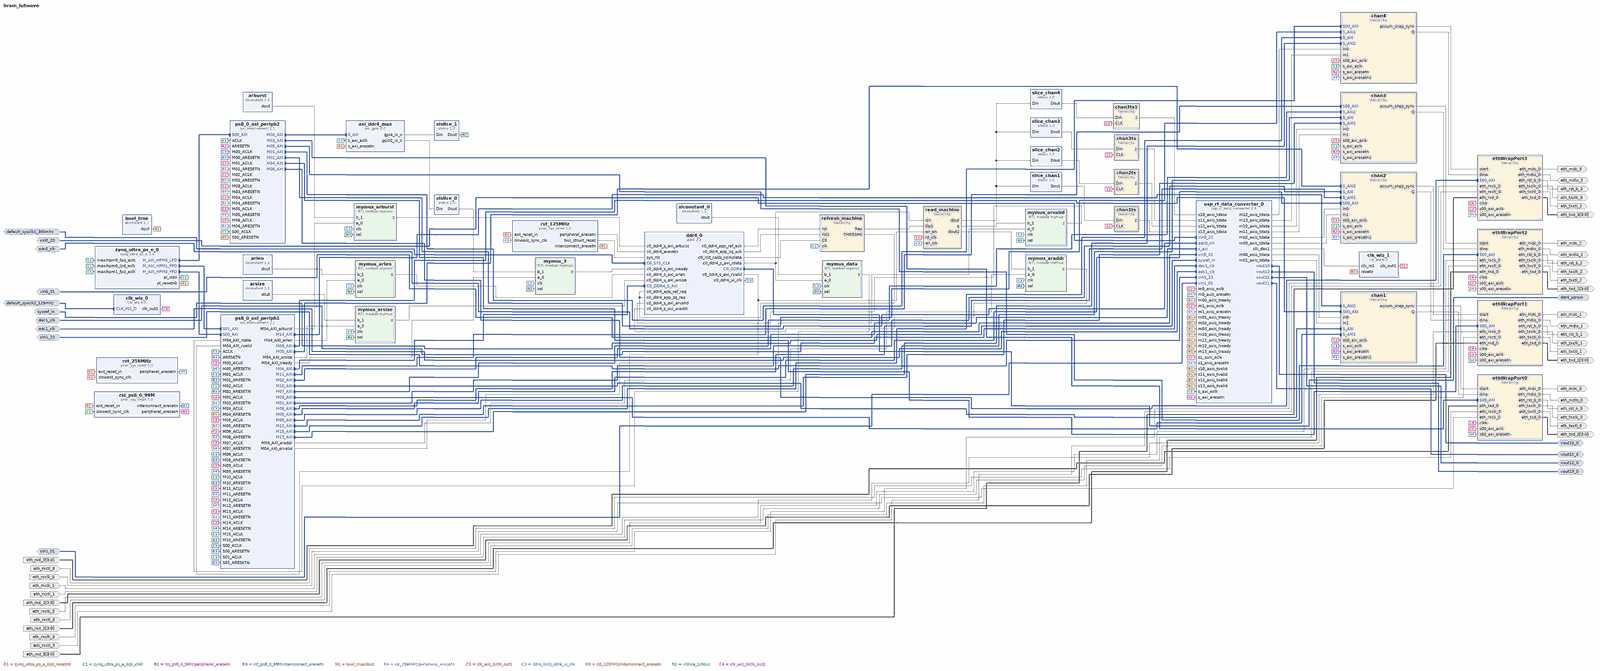
[diagram p0: block diagram of the top level, whole]
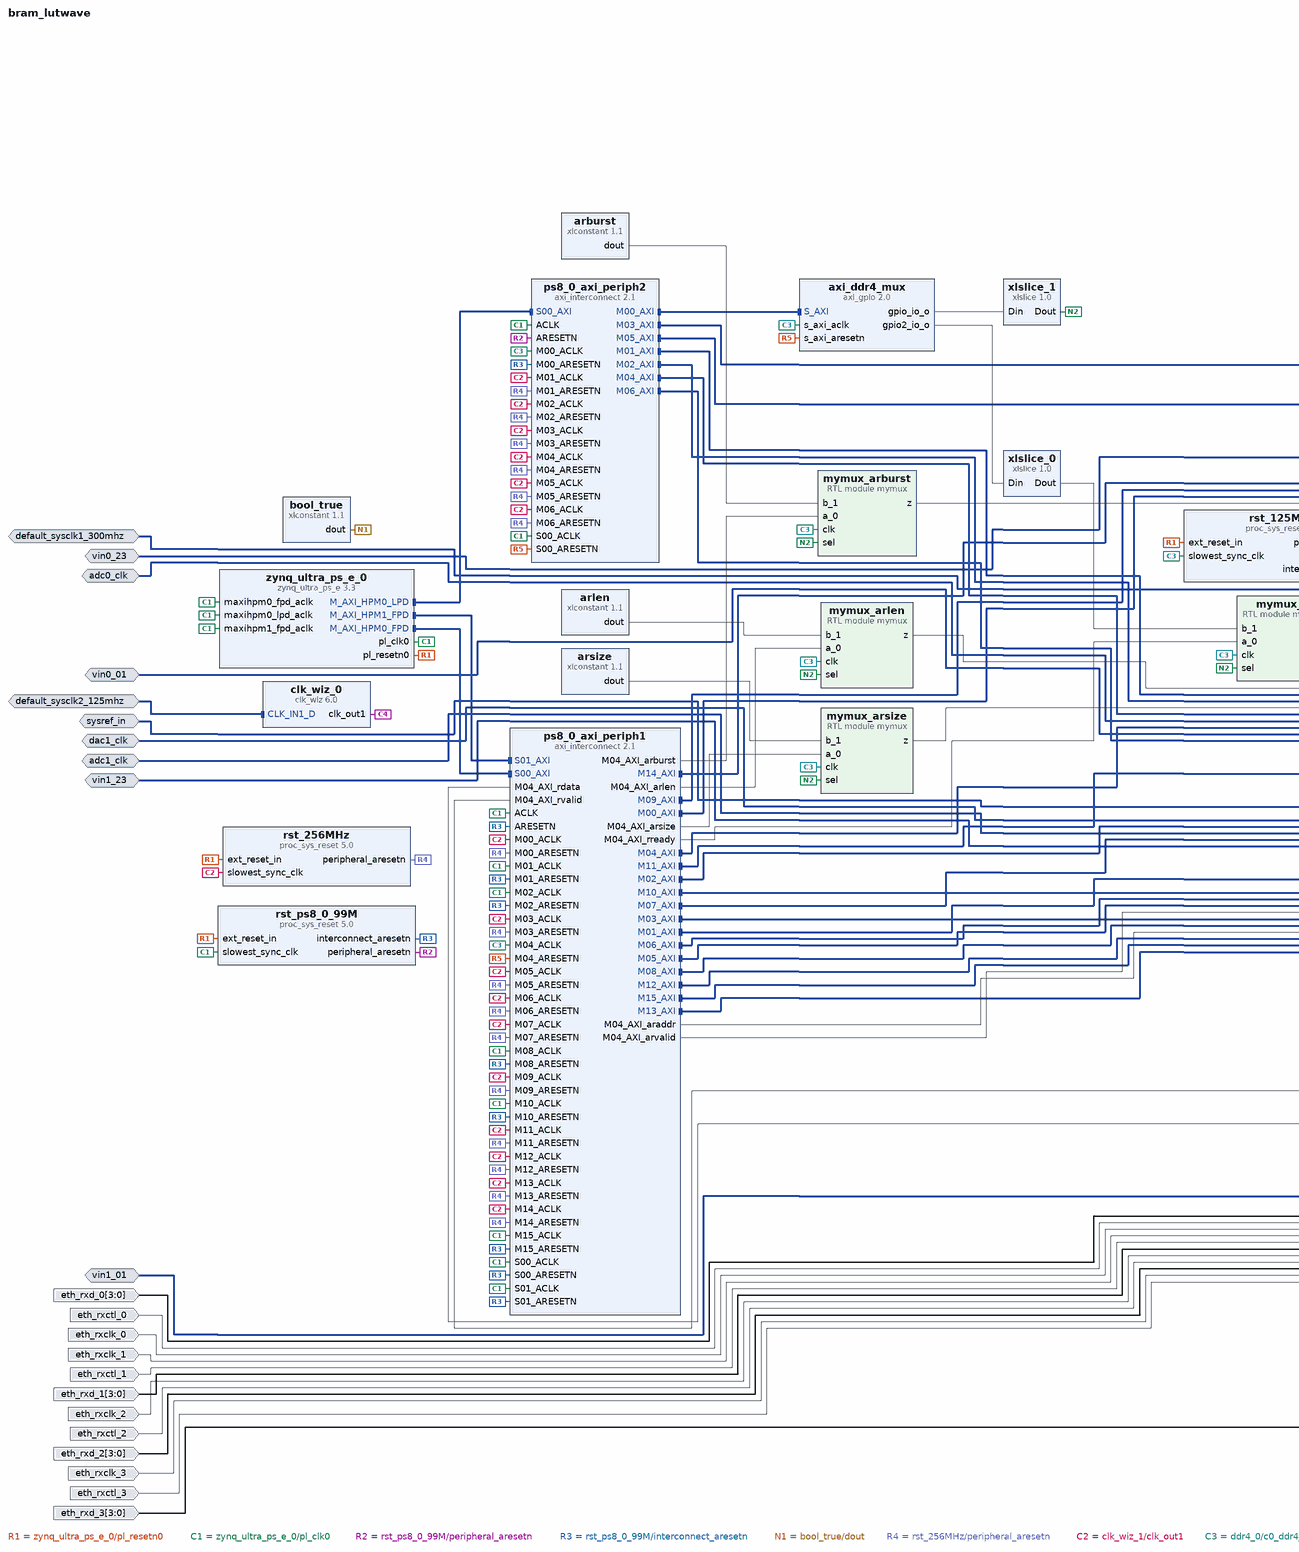
[diagram p1: block diagram of the top level, left part]
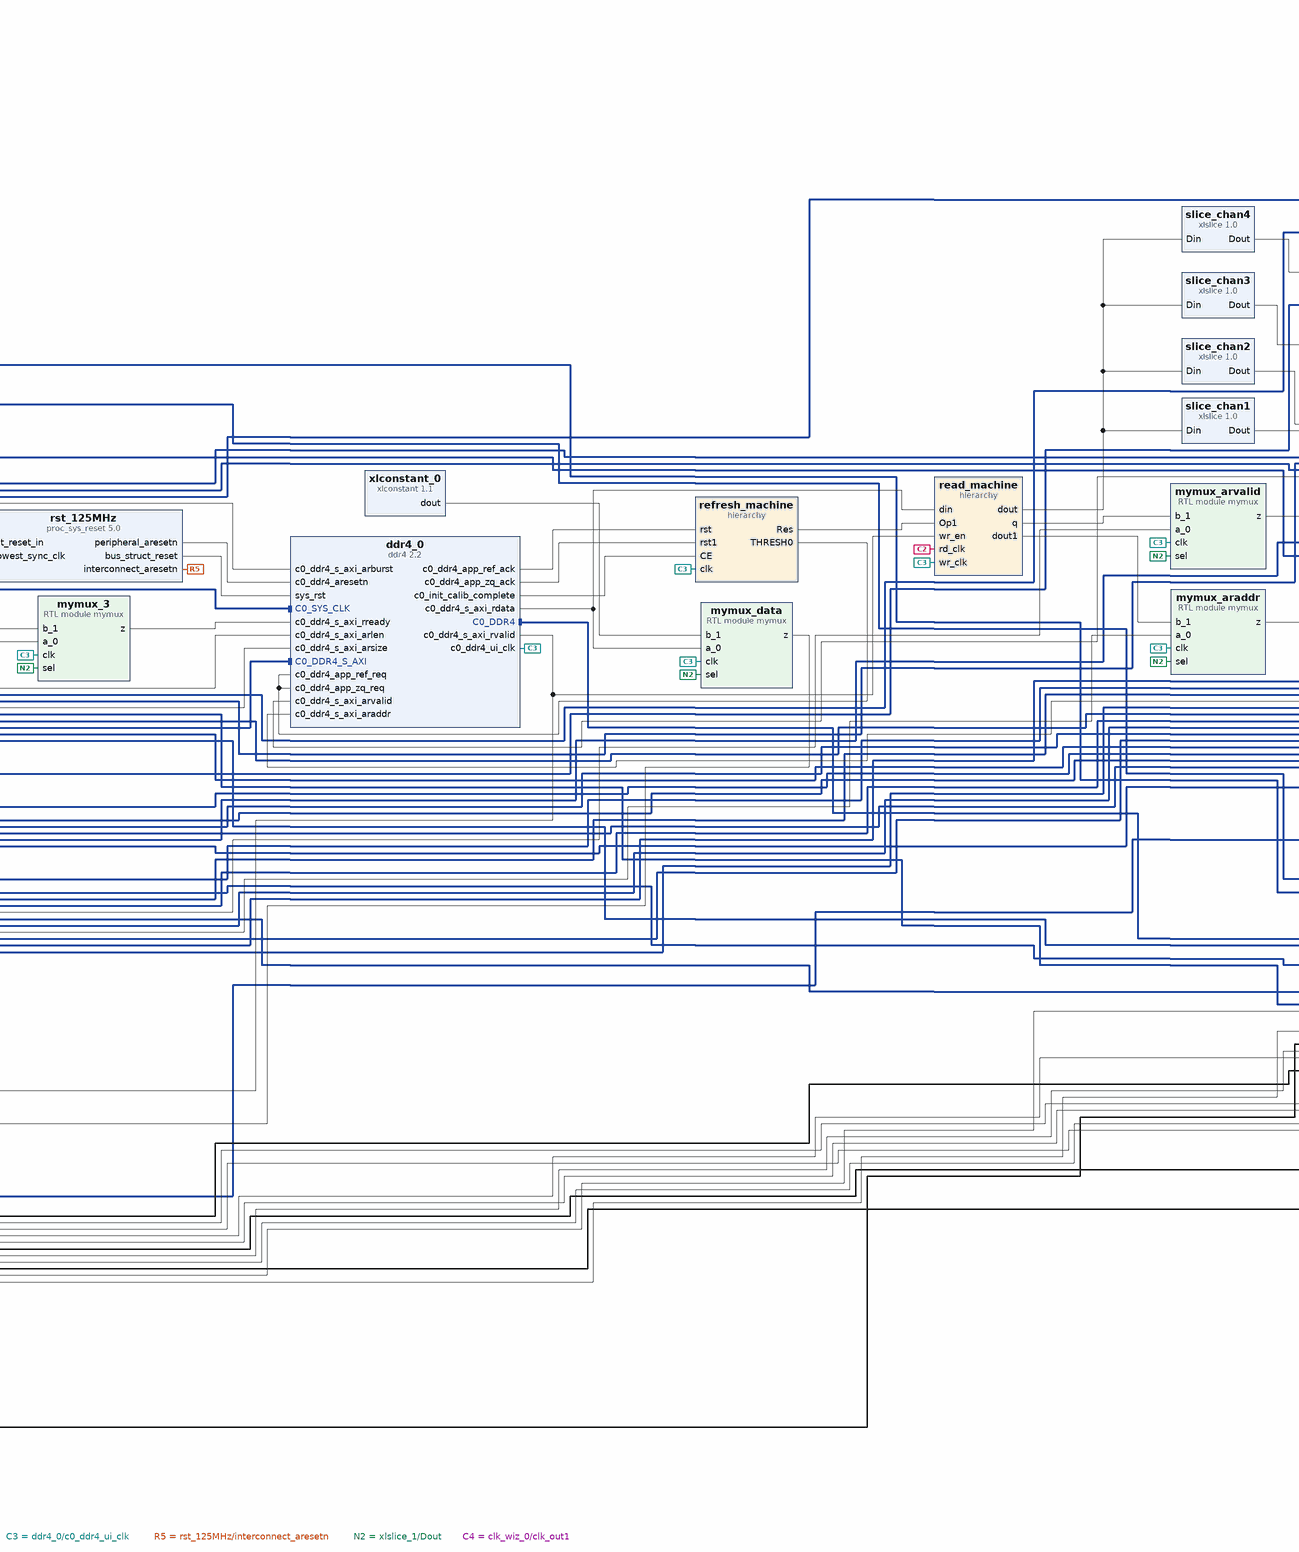
[diagram p2: block diagram of the top level, centre part]
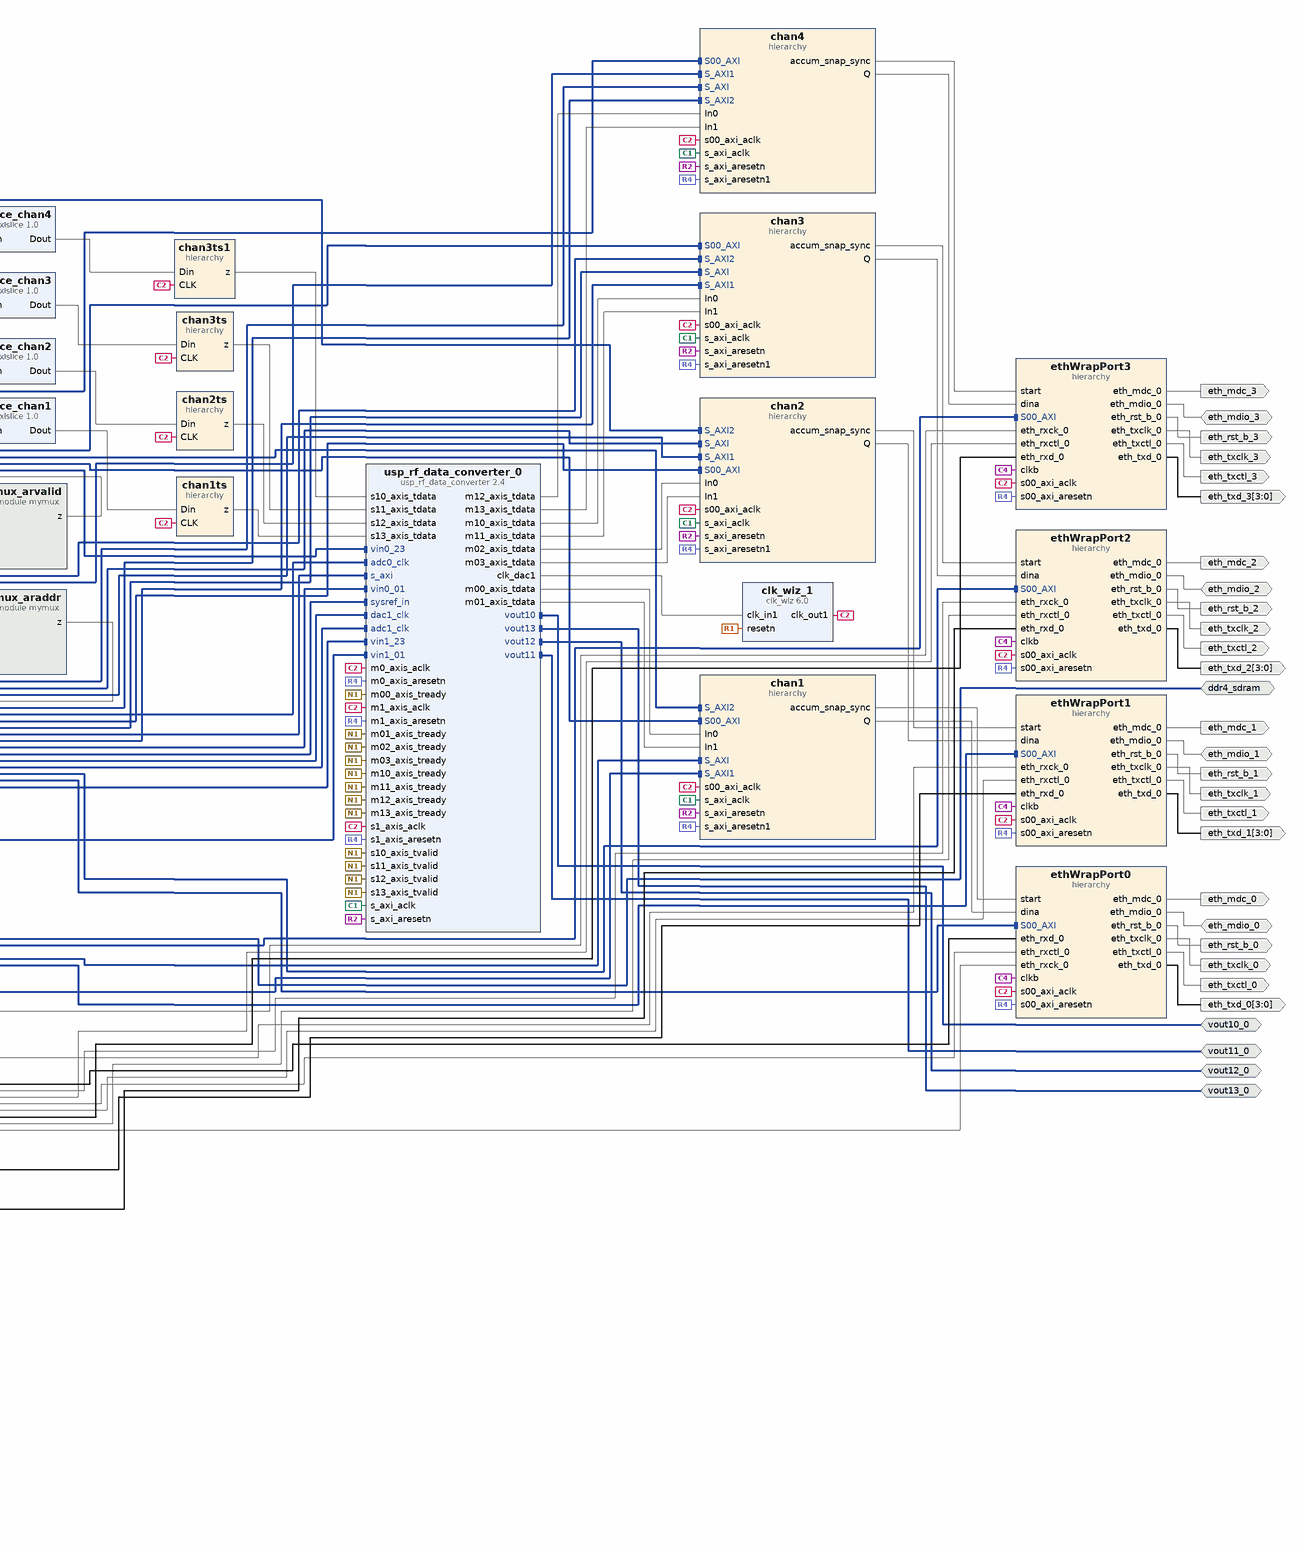
[diagram p3: block diagram of the top level, right part]
# Vivado block design bram_lutwave, xczu28dr-ffvg1517-2-e, Vivado 2020.2
create_bd_design bram_lutwave

create_bd_intf_port -mode Slave -vlnv xilinx.com:display_usp_rf_data_converter:diff_pins_rtl:1.0 sysref_in
create_bd_intf_port -mode Slave -vlnv xilinx.com:interface:diff_clock_rtl:1.0 dac1_clk
set_property -dict {CONFIG.FREQ_HZ 409600000.0} [get_bd_intf_ports dac1_clk]
create_bd_intf_port -mode Master -vlnv xilinx.com:interface:diff_analog_io_rtl:1.0 vout13_0
create_bd_intf_port -mode Slave -vlnv xilinx.com:interface:diff_clock_rtl:1.0 adc0_clk
set_property -dict {CONFIG.FREQ_HZ 409600000.0} [get_bd_intf_ports adc0_clk]
create_bd_intf_port -mode Slave -vlnv xilinx.com:interface:diff_analog_io_rtl:1.0 vin0_01
create_bd_intf_port -mode Master -vlnv xilinx.com:interface:diff_analog_io_rtl:1.0 vout10_0
create_bd_intf_port -mode Master -vlnv xilinx.com:interface:diff_analog_io_rtl:1.0 vout11_0
create_bd_intf_port -mode Master -vlnv xilinx.com:interface:diff_analog_io_rtl:1.0 vout12_0
create_bd_intf_port -mode Slave -vlnv xilinx.com:interface:diff_analog_io_rtl:1.0 vin0_23
create_bd_intf_port -mode Slave -vlnv xilinx.com:interface:diff_clock_rtl:1.0 adc1_clk
set_property -dict {CONFIG.FREQ_HZ 409600000.0} [get_bd_intf_ports adc1_clk]
create_bd_intf_port -mode Slave -vlnv xilinx.com:interface:diff_analog_io_rtl:1.0 vin1_01
create_bd_intf_port -mode Slave -vlnv xilinx.com:interface:diff_analog_io_rtl:1.0 vin1_23
create_bd_intf_port -mode Master -vlnv xilinx.com:interface:ddr4_rtl:1.0 ddr4_sdram
create_bd_intf_port -mode Slave -vlnv xilinx.com:interface:diff_clock_rtl:1.0 default_sysclk1_300mhz
set_property -dict {CONFIG.FREQ_HZ 300000000} [get_bd_intf_ports default_sysclk1_300mhz]
create_bd_intf_port -mode Slave -vlnv xilinx.com:interface:diff_clock_rtl:1.0 default_sysclk2_125mhz
set_property -dict {CONFIG.FREQ_HZ 125000000} [get_bd_intf_ports default_sysclk2_125mhz]
create_bd_port -dir IO eth_mdio_0
create_bd_port -dir O eth_txctl_0
create_bd_port -dir O eth_mdc_0
create_bd_port -dir O eth_rst_b_0
create_bd_port -dir O eth_txclk_0
create_bd_port -dir O -from 3 -to 0 eth_txd_0
create_bd_port -dir I -from 3 -to 0 eth_rxd_0
create_bd_port -dir I eth_rxctl_0
create_bd_port -dir I eth_rxclk_0
create_bd_port -dir O eth_rst_b_1
create_bd_port -dir O eth_txclk_1
create_bd_port -dir O eth_txctl_1
create_bd_port -dir O eth_mdc_1
create_bd_port -dir IO eth_mdio_1
create_bd_port -dir O -from 3 -to 0 eth_txd_1
create_bd_port -dir I eth_rxclk_1
create_bd_port -dir I eth_rxctl_1
create_bd_port -dir I -from 3 -to 0 eth_rxd_1
create_bd_port -dir O eth_txclk_2
create_bd_port -dir O eth_txctl_2
create_bd_port -dir O eth_mdc_2
create_bd_port -dir IO eth_mdio_2
create_bd_port -dir O eth_rst_b_2
create_bd_port -dir O -from 3 -to 0 eth_txd_2
create_bd_port -dir I eth_rxclk_2
create_bd_port -dir I eth_rxctl_2
create_bd_port -dir I -from 3 -to 0 eth_rxd_2
create_bd_port -dir O eth_txclk_3
create_bd_port -dir O eth_txctl_3
create_bd_port -dir O eth_mdc_3
create_bd_port -dir IO eth_mdio_3
create_bd_port -dir O eth_rst_b_3
create_bd_port -dir O -from 3 -to 0 eth_txd_3
create_bd_port -dir I eth_rxclk_3
create_bd_port -dir I eth_rxctl_3
create_bd_port -dir I -from 3 -to 0 eth_rxd_3

create_bd_cell -type ip -vlnv xilinx.com:ip:proc_sys_reset:5.0 rst_ps8_0_99M
create_bd_cell -type ip -vlnv xilinx.com:ip:proc_sys_reset:5.0 rst_256MHz
create_bd_cell -type ip -vlnv xilinx.com:ip:clk_wiz:6.0 clk_wiz_1
set_property -dict [list \
  CONFIG.CLKIN1_JITTER_PS 39.06 \
  CONFIG.CLKOUT1_DRIVES Buffer \
  CONFIG.CLKOUT1_JITTER 86.016 \
  CONFIG.CLKOUT1_PHASE_ERROR 89.770 \
  CONFIG.CLKOUT1_REQUESTED_OUT_FREQ 256.00 \
  CONFIG.CLKOUT2_DRIVES Buffer \
  CONFIG.CLKOUT2_JITTER 103.466 \
  CONFIG.CLKOUT2_PHASE_ERROR 89.770 \
  CONFIG.CLKOUT2_REQUESTED_OUT_FREQ 100 \
  CONFIG.CLKOUT2_USED true \
  CONFIG.CLKOUT3_DRIVES Buffer \
  CONFIG.CLKOUT4_DRIVES Buffer \
  CONFIG.CLKOUT5_DRIVES Buffer \
  CONFIG.CLKOUT6_DRIVES Buffer \
  CONFIG.CLKOUT7_DRIVES Buffer \
  CONFIG.FEEDBACK_SOURCE FDBK_AUTO \
  CONFIG.MMCM_CLKFBOUT_MULT_F 3.125 \
  CONFIG.MMCM_CLKIN1_PERIOD 3.906 \
  CONFIG.MMCM_CLKIN2_PERIOD 10.0 \
  CONFIG.MMCM_CLKOUT0_DIVIDE_F 3.125 \
  CONFIG.MMCM_CLKOUT1_DIVIDE 8 \
  CONFIG.MMCM_COMPENSATION AUTO \
  CONFIG.MMCM_DIVCLK_DIVIDE 1 \
  CONFIG.NUM_OUT_CLKS 2 \
  CONFIG.OVERRIDE_MMCM false \
  CONFIG.PRIMITIVE MMCM \
  CONFIG.PRIM_IN_FREQ 256 \
  CONFIG.RESET_BOARD_INTERFACE Custom \
  CONFIG.RESET_PORT resetn \
  CONFIG.RESET_TYPE ACTIVE_LOW \
  CONFIG.USE_BOARD_FLOW true \
  CONFIG.USE_LOCKED false \
] [get_bd_cells clk_wiz_1]
create_bd_cell -type ip -vlnv xilinx.com:ip:axi_interconnect:2.1 ps8_0_axi_periph2
set_property -dict {CONFIG.NUM_MI 7 CONFIG.NUM_SI 1} [get_bd_cells ps8_0_axi_periph2]
create_bd_cell -type ip -vlnv xilinx.com:ip:axi_interconnect:2.1 ps8_0_axi_periph1
set_property -dict {CONFIG.NUM_MI 16 CONFIG.NUM_SI 2} [get_bd_cells ps8_0_axi_periph1]
create_bd_cell -type ip -vlnv xilinx.com:ip:usp_rf_data_converter:2.4 usp_rf_data_converter_0
set_property -dict [list \
  CONFIG.ADC0_Outclk_Freq 256.000 \
  CONFIG.ADC0_PLL_Enable true \
  CONFIG.ADC0_Refclk_Div 1 \
  CONFIG.ADC0_Refclk_Freq 409.600 \
  CONFIG.ADC0_Sampling_Rate 4.096 \
  CONFIG.ADC1_Outclk_Freq 256.000 \
  CONFIG.ADC1_PLL_Enable true \
  CONFIG.ADC1_Refclk_Freq 409.600 \
  CONFIG.ADC1_Sampling_Rate 4.096 \
  CONFIG.ADC_CalOpt_Mode00 1 \
  CONFIG.ADC_CalOpt_Mode02 1 \
  CONFIG.ADC_CalOpt_Mode10 1 \
  CONFIG.ADC_CalOpt_Mode12 1 \
  CONFIG.ADC_Data_Type00 1 \
  CONFIG.ADC_Data_Type02 1 \
  CONFIG.ADC_Data_Type10 1 \
  CONFIG.ADC_Data_Type12 1 \
  CONFIG.ADC_Data_Width00 2 \
  CONFIG.ADC_Data_Width02 2 \
  CONFIG.ADC_Data_Width10 2 \
  CONFIG.ADC_Data_Width12 2 \
  CONFIG.ADC_Debug false \
  CONFIG.ADC_Decimation_Mode00 8 \
  CONFIG.ADC_Decimation_Mode02 8 \
  CONFIG.ADC_Decimation_Mode10 8 \
  CONFIG.ADC_Decimation_Mode12 8 \
  CONFIG.ADC_Dither00 false \
  CONFIG.ADC_Dither02 false \
  CONFIG.ADC_Dither10 false \
  CONFIG.ADC_Dither12 false \
  CONFIG.ADC_Mixer_Mode00 0 \
  CONFIG.ADC_Mixer_Mode02 0 \
  CONFIG.ADC_Mixer_Mode10 0 \
  CONFIG.ADC_Mixer_Mode12 0 \
  CONFIG.ADC_Mixer_Type00 2 \
  CONFIG.ADC_Mixer_Type01 2 \
  CONFIG.ADC_Mixer_Type02 2 \
  CONFIG.ADC_Mixer_Type03 2 \
  CONFIG.ADC_Mixer_Type10 2 \
  CONFIG.ADC_Mixer_Type11 2 \
  CONFIG.ADC_Mixer_Type12 2 \
  CONFIG.ADC_Mixer_Type13 2 \
  CONFIG.ADC_NCO_Freq00 0.0 \
  CONFIG.ADC_NCO_Freq02 0 \
  CONFIG.ADC_NCO_Freq10 0.0 \
  CONFIG.ADC_Nyquist00 0 \
  CONFIG.ADC_RTS false \
  CONFIG.ADC_Slice00_Enable true \
  CONFIG.ADC_Slice02_Enable true \
  CONFIG.ADC_Slice10_Enable true \
  CONFIG.ADC_Slice12_Enable true \
  CONFIG.Converter_Setup 1 \
  CONFIG.DAC1_Outclk_Freq 256.000 \
  CONFIG.DAC1_PLL_Enable true \
  CONFIG.DAC1_Refclk_Freq 409.600 \
  CONFIG.DAC1_Sampling_Rate 4.096 \
  CONFIG.DAC_Data_Type12 0 \
  CONFIG.DAC_Data_Width10 4 \
  CONFIG.DAC_Data_Width11 4 \
  CONFIG.DAC_Data_Width12 4 \
  CONFIG.DAC_Data_Width13 4 \
  CONFIG.DAC_Interpolation_Mode10 8 \
  CONFIG.DAC_Interpolation_Mode11 8 \
  CONFIG.DAC_Interpolation_Mode12 8 \
  CONFIG.DAC_Interpolation_Mode13 8 \
  CONFIG.DAC_Mixer_Mode10 0 \
  CONFIG.DAC_Mixer_Mode11 0 \
  CONFIG.DAC_Mixer_Mode12 0 \
  CONFIG.DAC_Mixer_Mode13 0 \
  CONFIG.DAC_Mixer_Type10 2 \
  CONFIG.DAC_Mixer_Type11 2 \
  CONFIG.DAC_Mixer_Type12 2 \
  CONFIG.DAC_Mixer_Type13 2 \
  CONFIG.DAC_Slice10_Enable true \
  CONFIG.DAC_Slice11_Enable true \
  CONFIG.DAC_Slice12_Enable true \
  CONFIG.DAC_Slice13_Enable true \
] [get_bd_cells usp_rf_data_converter_0]
create_bd_cell -type ip -vlnv xilinx.com:ip:xlconstant:1.1 bool_true
create_bd_cell -type ip -vlnv xilinx.com:ip:zynq_ultra_ps_e:3.3 zynq_ultra_ps_e_0
set_property -dict [list \
  CONFIG.CAN0_BOARD_INTERFACE custom \
  CONFIG.CAN1_BOARD_INTERFACE custom \
  CONFIG.CSU_BOARD_INTERFACE custom \
  CONFIG.DP_BOARD_INTERFACE custom \
  CONFIG.GEM0_BOARD_INTERFACE custom \
  CONFIG.GEM1_BOARD_INTERFACE custom \
  CONFIG.GEM2_BOARD_INTERFACE custom \
  CONFIG.GEM3_BOARD_INTERFACE custom \
  CONFIG.GPIO_BOARD_INTERFACE custom \
  CONFIG.IIC0_BOARD_INTERFACE custom \
  CONFIG.IIC1_BOARD_INTERFACE custom \
  CONFIG.NAND_BOARD_INTERFACE custom \
  CONFIG.PCIE_BOARD_INTERFACE custom \
  CONFIG.PJTAG_BOARD_INTERFACE custom \
  CONFIG.PMU_BOARD_INTERFACE custom \
  CONFIG.PSU_BANK_0_IO_STANDARD LVCMOS18 \
  CONFIG.PSU_BANK_1_IO_STANDARD LVCMOS18 \
  CONFIG.PSU_BANK_2_IO_STANDARD LVCMOS18 \
  CONFIG.PSU_BANK_3_IO_STANDARD LVCMOS33 \
  CONFIG.PSU_USB3__DUAL_CLOCK_ENABLE 1 \
  CONFIG.PSU__CAN1__PERIPHERAL__ENABLE 0 \
  CONFIG.PSU__CRF_APB__ACPU_CTRL__FREQMHZ 1200 \
  CONFIG.PSU__CRF_APB__ACPU_CTRL__SRCSEL APLL \
  CONFIG.PSU__CRF_APB__APLL_CTRL__SRCSEL PSS_REF_CLK \
  CONFIG.PSU__CRF_APB__DBG_FPD_CTRL__FREQMHZ 250 \
  CONFIG.PSU__CRF_APB__DBG_FPD_CTRL__SRCSEL IOPLL \
  CONFIG.PSU__CRF_APB__DBG_TRACE_CTRL__FREQMHZ 250 \
  CONFIG.PSU__CRF_APB__DBG_TRACE_CTRL__SRCSEL IOPLL \
  CONFIG.PSU__CRF_APB__DBG_TSTMP_CTRL__FREQMHZ 250 \
  CONFIG.PSU__CRF_APB__DBG_TSTMP_CTRL__SRCSEL IOPLL \
  CONFIG.PSU__CRF_APB__DDR_CTRL__FREQMHZ 1067 \
  CONFIG.PSU__CRF_APB__DDR_CTRL__SRCSEL DPLL \
  CONFIG.PSU__CRF_APB__DPDMA_REF_CTRL__FREQMHZ 600 \
  CONFIG.PSU__CRF_APB__DPDMA_REF_CTRL__SRCSEL APLL \
  CONFIG.PSU__CRF_APB__DPLL_CTRL__SRCSEL PSS_REF_CLK \
  CONFIG.PSU__CRF_APB__DP_AUDIO_REF_CTRL__SRCSEL RPLL \
  CONFIG.PSU__CRF_APB__DP_STC_REF_CTRL__SRCSEL RPLL \
  CONFIG.PSU__CRF_APB__DP_VIDEO_REF_CTRL__SRCSEL VPLL \
  CONFIG.PSU__CRF_APB__GDMA_REF_CTRL__FREQMHZ 600 \
  CONFIG.PSU__CRF_APB__GDMA_REF_CTRL__SRCSEL APLL \
  CONFIG.PSU__CRF_APB__GPU_REF_CTRL__FREQMHZ 500 \
  CONFIG.PSU__CRF_APB__GPU_REF_CTRL__SRCSEL IOPLL \
  CONFIG.PSU__CRF_APB__TOPSW_LSBUS_CTRL__FREQMHZ 100 \
  CONFIG.PSU__CRF_APB__TOPSW_LSBUS_CTRL__SRCSEL IOPLL \
  CONFIG.PSU__CRF_APB__TOPSW_MAIN_CTRL__FREQMHZ 533.33 \
  CONFIG.PSU__CRF_APB__TOPSW_MAIN_CTRL__SRCSEL DPLL \
  CONFIG.PSU__CRF_APB__VPLL_CTRL__SRCSEL PSS_REF_CLK \
  CONFIG.PSU__CRL_APB__ADMA_REF_CTRL__FREQMHZ 500 \
  CONFIG.PSU__CRL_APB__ADMA_REF_CTRL__SRCSEL IOPLL \
  CONFIG.PSU__CRL_APB__CAN1_REF_CTRL__FREQMHZ 100 \
  CONFIG.PSU__CRL_APB__CAN1_REF_CTRL__SRCSEL IOPLL \
  CONFIG.PSU__CRL_APB__CPU_R5_CTRL__FREQMHZ 500 \
  CONFIG.PSU__CRL_APB__CPU_R5_CTRL__SRCSEL IOPLL \
  CONFIG.PSU__CRL_APB__DBG_LPD_CTRL__FREQMHZ 250 \
  CONFIG.PSU__CRL_APB__DBG_LPD_CTRL__SRCSEL IOPLL \
  CONFIG.PSU__CRL_APB__GEM3_REF_CTRL__FREQMHZ 125 \
  CONFIG.PSU__CRL_APB__GEM3_REF_CTRL__SRCSEL IOPLL \
  CONFIG.PSU__CRL_APB__I2C0_REF_CTRL__FREQMHZ 100 \
  CONFIG.PSU__CRL_APB__I2C0_REF_CTRL__SRCSEL IOPLL \
  CONFIG.PSU__CRL_APB__I2C1_REF_CTRL__FREQMHZ 100 \
  CONFIG.PSU__CRL_APB__I2C1_REF_CTRL__SRCSEL IOPLL \
  CONFIG.PSU__CRL_APB__IOPLL_CTRL__SRCSEL PSS_REF_CLK \
  CONFIG.PSU__CRL_APB__IOU_SWITCH_CTRL__FREQMHZ 250 \
  CONFIG.PSU__CRL_APB__IOU_SWITCH_CTRL__SRCSEL IOPLL \
  CONFIG.PSU__CRL_APB__LPD_LSBUS_CTRL__FREQMHZ 100 \
  CONFIG.PSU__CRL_APB__LPD_LSBUS_CTRL__SRCSEL IOPLL \
  CONFIG.PSU__CRL_APB__LPD_SWITCH_CTRL__FREQMHZ 500 \
  CONFIG.PSU__CRL_APB__LPD_SWITCH_CTRL__SRCSEL IOPLL \
  CONFIG.PSU__CRL_APB__PCAP_CTRL__FREQMHZ 200 \
  CONFIG.PSU__CRL_APB__PCAP_CTRL__SRCSEL IOPLL \
  CONFIG.PSU__CRL_APB__PL0_REF_CTRL__FREQMHZ 100 \
  CONFIG.PSU__CRL_APB__PL0_REF_CTRL__SRCSEL IOPLL \
  CONFIG.PSU__CRL_APB__QSPI_REF_CTRL__FREQMHZ 125 \
  CONFIG.PSU__CRL_APB__QSPI_REF_CTRL__SRCSEL IOPLL \
  CONFIG.PSU__CRL_APB__RPLL_CTRL__SRCSEL PSS_REF_CLK \
  CONFIG.PSU__CRL_APB__SDIO1_REF_CTRL__FREQMHZ 200 \
  CONFIG.PSU__CRL_APB__SDIO1_REF_CTRL__SRCSEL IOPLL \
  CONFIG.PSU__CRL_APB__TIMESTAMP_REF_CTRL__FREQMHZ 100 \
  CONFIG.PSU__CRL_APB__TIMESTAMP_REF_CTRL__SRCSEL IOPLL \
  CONFIG.PSU__CRL_APB__UART0_REF_CTRL__FREQMHZ 100 \
  CONFIG.PSU__CRL_APB__UART0_REF_CTRL__SRCSEL IOPLL \
  CONFIG.PSU__CRL_APB__UART1_REF_CTRL__FREQMHZ 100 \
  CONFIG.PSU__CRL_APB__UART1_REF_CTRL__SRCSEL IOPLL \
  CONFIG.PSU__CRL_APB__USB0_BUS_REF_CTRL__FREQMHZ 250 \
  CONFIG.PSU__CRL_APB__USB0_BUS_REF_CTRL__SRCSEL IOPLL \
  CONFIG.PSU__CRL_APB__USB3_DUAL_REF_CTRL__FREQMHZ 20 \
  CONFIG.PSU__CRL_APB__USB3_DUAL_REF_CTRL__SRCSEL IOPLL \
  CONFIG.PSU__CRL_APB__USB3__ENABLE 1 \
  CONFIG.PSU__CSUPMU__PERIPHERAL__VALID 1 \
  CONFIG.PSU__DDRC__BUS_WIDTH {64 Bit} \
  CONFIG.PSU__DDRC__COMPONENTS UDIMM \
  CONFIG.PSU__DDRC__DEVICE_CAPACITY {8192 MBits} \
  CONFIG.PSU__DDRC__DRAM_WIDTH {16 Bits} \
  CONFIG.PSU__DDRC__ECC Disabled \
  CONFIG.PSU__DDRC__MEMORY_TYPE {DDR 4} \
  CONFIG.PSU__DDRC__SPEED_BIN DDR4_2133P \
  CONFIG.PSU__DDR_HIGH_ADDRESS_GUI_ENABLE 1 \
  CONFIG.PSU__DDR__INTERFACE__FREQMHZ 533.500 \
  CONFIG.PSU__DEVICE_TYPE RFSOC \
  CONFIG.PSU__DISPLAYPORT__LANE0__ENABLE 1 \
  CONFIG.PSU__DISPLAYPORT__LANE0__IO {GT Lane1} \
  CONFIG.PSU__DISPLAYPORT__LANE1__ENABLE 1 \
  CONFIG.PSU__DISPLAYPORT__LANE1__IO {GT Lane0} \
  CONFIG.PSU__DISPLAYPORT__PERIPHERAL__ENABLE 1 \
  CONFIG.PSU__DLL__ISUSED 1 \
  CONFIG.PSU__DPAUX__PERIPHERAL__ENABLE 1 \
  CONFIG.PSU__DPAUX__PERIPHERAL__IO {MIO 27 .. 30} \
  CONFIG.PSU__DP__LANE_SEL {Dual Lower} \
  CONFIG.PSU__DP__REF_CLK_FREQ 27 \
  CONFIG.PSU__DP__REF_CLK_SEL {Ref Clk1} \
  CONFIG.PSU__ENET3__FIFO__ENABLE 0 \
  CONFIG.PSU__ENET3__GRP_MDIO__ENABLE 1 \
  CONFIG.PSU__ENET3__GRP_MDIO__IO {MIO 76 .. 77} \
  CONFIG.PSU__ENET3__PERIPHERAL__ENABLE 1 \
  CONFIG.PSU__ENET3__PERIPHERAL__IO {MIO 64 .. 75} \
  CONFIG.PSU__ENET3__PTP__ENABLE 0 \
  CONFIG.PSU__ENET3__TSU__ENABLE 0 \
  CONFIG.PSU__FPGA_PL0_ENABLE 1 \
  CONFIG.PSU__GEM3_COHERENCY 0 \
  CONFIG.PSU__GEM3_ROUTE_THROUGH_FPD 0 \
  CONFIG.PSU__GEM__TSU__ENABLE 0 \
  CONFIG.PSU__GPIO0_MIO__IO {MIO 0 .. 25} \
  CONFIG.PSU__GPIO0_MIO__PERIPHERAL__ENABLE 1 \
  CONFIG.PSU__GPIO1_MIO__IO {MIO 26 .. 51} \
  CONFIG.PSU__GPIO1_MIO__PERIPHERAL__ENABLE 1 \
  CONFIG.PSU__GPU_PP0__POWER__ON 0 \
  CONFIG.PSU__GPU_PP1__POWER__ON 0 \
  CONFIG.PSU__GT__LINK_SPEED HBR \
  CONFIG.PSU__GT__PRE_EMPH_LVL_4 0 \
  CONFIG.PSU__GT__VLT_SWNG_LVL_4 0 \
  CONFIG.PSU__I2C0__PERIPHERAL__ENABLE 1 \
  CONFIG.PSU__I2C0__PERIPHERAL__IO {MIO 14 .. 15} \
  CONFIG.PSU__I2C1__PERIPHERAL__ENABLE 1 \
  CONFIG.PSU__I2C1__PERIPHERAL__IO {MIO 16 .. 17} \
  CONFIG.PSU__IOU_SLCR__IOU_TTC_APB_CLK__TTC0_SEL APB \
  CONFIG.PSU__IOU_SLCR__IOU_TTC_APB_CLK__TTC1_SEL APB \
  CONFIG.PSU__IOU_SLCR__IOU_TTC_APB_CLK__TTC2_SEL APB \
  CONFIG.PSU__IOU_SLCR__IOU_TTC_APB_CLK__TTC3_SEL APB \
  CONFIG.PSU__MAXIGP0__DATA_WIDTH 128 \
  CONFIG.PSU__MAXIGP2__DATA_WIDTH 128 \
  CONFIG.PSU__OVERRIDE__BASIC_CLOCK 0 \
  CONFIG.PSU__PMU_COHERENCY 0 \
  CONFIG.PSU__PMU__AIBACK__ENABLE 0 \
  CONFIG.PSU__PMU__EMIO_GPI__ENABLE 0 \
  CONFIG.PSU__PMU__EMIO_GPO__ENABLE 0 \
  CONFIG.PSU__PMU__GPI0__ENABLE 0 \
  CONFIG.PSU__PMU__GPI1__ENABLE 0 \
  CONFIG.PSU__PMU__GPI2__ENABLE 0 \
  CONFIG.PSU__PMU__GPI3__ENABLE 0 \
  CONFIG.PSU__PMU__GPI4__ENABLE 0 \
  CONFIG.PSU__PMU__GPI5__ENABLE 0 \
  CONFIG.PSU__PMU__GPO0__ENABLE 1 \
  CONFIG.PSU__PMU__GPO0__IO {MIO 32} \
  CONFIG.PSU__PMU__GPO1__ENABLE 1 \
  CONFIG.PSU__PMU__GPO1__IO {MIO 33} \
  CONFIG.PSU__PMU__GPO2__ENABLE 1 \
  CONFIG.PSU__PMU__GPO2__IO {MIO 34} \
  CONFIG.PSU__PMU__GPO2__POLARITY low \
  CONFIG.PSU__PMU__GPO3__ENABLE 1 \
  CONFIG.PSU__PMU__GPO3__IO {MIO 35} \
  CONFIG.PSU__PMU__GPO3__POLARITY low \
  CONFIG.PSU__PMU__GPO4__ENABLE 1 \
  CONFIG.PSU__PMU__GPO4__IO {MIO 36} \
  CONFIG.PSU__PMU__GPO4__POLARITY low \
  CONFIG.PSU__PMU__GPO5__ENABLE 1 \
  CONFIG.PSU__PMU__GPO5__IO {MIO 37} \
  CONFIG.PSU__PMU__GPO5__POLARITY low \
  CONFIG.PSU__PMU__PERIPHERAL__ENABLE 1 \
  CONFIG.PSU__PMU__PLERROR__ENABLE 0 \
  CONFIG.PSU__PRESET_APPLIED 1 \
  CONFIG.PSU__PSS_REF_CLK__FREQMHZ 33.333 \
  CONFIG.PSU__QSPI_COHERENCY 0 \
  CONFIG.PSU__QSPI_ROUTE_THROUGH_FPD 0 \
  CONFIG.PSU__QSPI__GRP_FBCLK__ENABLE 1 \
  CONFIG.PSU__QSPI__GRP_FBCLK__IO {MIO 6} \
  CONFIG.PSU__QSPI__PERIPHERAL__DATA_MODE x4 \
  CONFIG.PSU__QSPI__PERIPHERAL__ENABLE 1 \
  CONFIG.PSU__QSPI__PERIPHERAL__IO {MIO 0 .. 12} \
  CONFIG.PSU__QSPI__PERIPHERAL__MODE {Dual Parallel} \
  CONFIG.PSU__SATA__LANE1__IO {GT Lane3} \
  CONFIG.PSU__SATA__PERIPHERAL__ENABLE 1 \
  CONFIG.PSU__SATA__REF_CLK_FREQ 125 \
  CONFIG.PSU__SATA__REF_CLK_SEL {Ref Clk3} \
  CONFIG.PSU__SD1_COHERENCY 0 \
  CONFIG.PSU__SD1_ROUTE_THROUGH_FPD 0 \
  CONFIG.PSU__SD1__DATA_TRANSFER_MODE 8Bit \
  CONFIG.PSU__SD1__GRP_CD__ENABLE 1 \
  CONFIG.PSU__SD1__GRP_CD__IO {MIO 45} \
  CONFIG.PSU__SD1__GRP_POW__ENABLE 0 \
  CONFIG.PSU__SD1__GRP_WP__ENABLE 0 \
  CONFIG.PSU__SD1__PERIPHERAL__ENABLE 1 \
  CONFIG.PSU__SD1__PERIPHERAL__IO {MIO 39 .. 51} \
  CONFIG.PSU__SD1__SLOT_TYPE {SD 3.0} \
  CONFIG.PSU__SWDT0__CLOCK__ENABLE 0 \
  CONFIG.PSU__SWDT0__PERIPHERAL__ENABLE 1 \
  CONFIG.PSU__SWDT0__RESET__ENABLE 0 \
  CONFIG.PSU__SWDT1__CLOCK__ENABLE 0 \
  CONFIG.PSU__SWDT1__PERIPHERAL__ENABLE 1 \
  CONFIG.PSU__SWDT1__RESET__ENABLE 0 \
  CONFIG.PSU__TSU__BUFG_PORT_PAIR 0 \
  CONFIG.PSU__TTC0__CLOCK__ENABLE 0 \
  CONFIG.PSU__TTC0__PERIPHERAL__ENABLE 1 \
  CONFIG.PSU__TTC0__WAVEOUT__ENABLE 0 \
  CONFIG.PSU__TTC1__CLOCK__ENABLE 0 \
  CONFIG.PSU__TTC1__PERIPHERAL__ENABLE 1 \
  CONFIG.PSU__TTC1__WAVEOUT__ENABLE 0 \
  CONFIG.PSU__TTC2__CLOCK__ENABLE 0 \
  CONFIG.PSU__TTC2__PERIPHERAL__ENABLE 1 \
  CONFIG.PSU__TTC2__WAVEOUT__ENABLE 0 \
  CONFIG.PSU__TTC3__CLOCK__ENABLE 0 \
  CONFIG.PSU__TTC3__PERIPHERAL__ENABLE 1 \
  CONFIG.PSU__TTC3__WAVEOUT__ENABLE 0 \
  CONFIG.PSU__UART0__BAUD_RATE 115200 \
  CONFIG.PSU__UART0__MODEM__ENABLE 0 \
  CONFIG.PSU__UART0__PERIPHERAL__ENABLE 1 \
  CONFIG.PSU__UART0__PERIPHERAL__IO {MIO 18 .. 19} \
  CONFIG.PSU__UART1__BAUD_RATE 115200 \
  CONFIG.PSU__UART1__MODEM__ENABLE 0 \
  CONFIG.PSU__UART1__PERIPHERAL__ENABLE 1 \
  CONFIG.PSU__UART1__PERIPHERAL__IO EMIO \
  CONFIG.PSU__USB0_COHERENCY 0 \
  CONFIG.PSU__USB0__PERIPHERAL__ENABLE 1 \
  CONFIG.PSU__USB0__PERIPHERAL__IO {MIO 52 .. 63} \
  CONFIG.PSU__USB0__REF_CLK_FREQ 26 \
  CONFIG.PSU__USB0__REF_CLK_SEL {Ref Clk2} \
  CONFIG.PSU__USB2_0__EMIO__ENABLE 0 \
  CONFIG.PSU__USB3_0__EMIO__ENABLE 0 \
  CONFIG.PSU__USB3_0__PERIPHERAL__ENABLE 1 \
  CONFIG.PSU__USB3_0__PERIPHERAL__IO {GT Lane2} \
  CONFIG.PSU__USB__RESET__MODE {Boot Pin} \
  CONFIG.PSU__USB__RESET__POLARITY {Active Low} \
  CONFIG.PSU__USE__IRQ0 1 \
  CONFIG.PSU__USE__M_AXI_GP0 1 \
  CONFIG.PSU__USE__M_AXI_GP1 1 \
  CONFIG.PSU__USE__M_AXI_GP2 1 \
  CONFIG.QSPI_BOARD_INTERFACE custom \
  CONFIG.SATA_BOARD_INTERFACE custom \
  CONFIG.SD0_BOARD_INTERFACE custom \
  CONFIG.SD1_BOARD_INTERFACE custom \
  CONFIG.SPI0_BOARD_INTERFACE custom \
  CONFIG.SPI1_BOARD_INTERFACE custom \
  CONFIG.SUBPRESET1 Custom \
  CONFIG.SUBPRESET2 Custom \
  CONFIG.SWDT0_BOARD_INTERFACE custom \
  CONFIG.SWDT1_BOARD_INTERFACE custom \
  CONFIG.TRACE_BOARD_INTERFACE custom \
  CONFIG.TTC0_BOARD_INTERFACE custom \
  CONFIG.TTC1_BOARD_INTERFACE custom \
  CONFIG.TTC2_BOARD_INTERFACE custom \
  CONFIG.TTC3_BOARD_INTERFACE custom \
  CONFIG.UART0_BOARD_INTERFACE custom \
  CONFIG.UART1_BOARD_INTERFACE custom \
  CONFIG.USB0_BOARD_INTERFACE custom \
  CONFIG.USB1_BOARD_INTERFACE custom \
] [get_bd_cells zynq_ultra_ps_e_0]
# 736 more settings of zynq_ultra_ps_e_0 are not shown: defaults, MIO pin electricals, DDR timing, and values the tool derives
create_bd_cell -type ip -vlnv xilinx.com:ip:proc_sys_reset:5.0 rst_125MHz
create_bd_cell -type hier chan1
create_bd_cell -type ip -vlnv xilinx.com:ip:ddr4:2.2 ddr4_0
set_property -dict [list \
  CONFIG.C0.DDR4_UserRefresh_ZQCS true \
  CONFIG.C0_CLOCK_BOARD_INTERFACE default_sysclk1_300mhz \
  CONFIG.C0_DDR4_BOARD_INTERFACE ddr4_sdram \
  CONFIG.RESET_BOARD_INTERFACE Custom \
] [get_bd_cells ddr4_0]
create_bd_cell -type module -reference mymux mymux_data
set_property -dict {CONFIG.width 512} [get_bd_cells mymux_data]
create_bd_cell -type ip -vlnv xilinx.com:ip:xlconstant:1.1 xlconstant_0
set_property -dict {CONFIG.CONST_VAL 0 CONFIG.CONST_WIDTH 512} [get_bd_cells xlconstant_0]
create_bd_cell -type module -reference mymux mymux_araddr
set_property -dict {CONFIG.width 32} [get_bd_cells mymux_araddr]
create_bd_cell -type module -reference mymux mymux_arvalid
set_property -dict {CONFIG.width 1} [get_bd_cells mymux_arvalid]
create_bd_cell -type module -reference mymux mymux_3
set_property -dict {CONFIG.width 1} [get_bd_cells mymux_3]
create_bd_cell -type ip -vlnv xilinx.com:ip:axi_gpio:2.0 axi_ddr4_mux
set_property -dict {CONFIG.C_ALL_OUTPUTS 1 CONFIG.C_ALL_OUTPUTS_2 1 CONFIG.C_IS_DUAL 1} [get_bd_cells axi_ddr4_mux]
create_bd_cell -type ip -vlnv xilinx.com:ip:xlslice:1.0 xlslice_0
create_bd_cell -type ip -vlnv xilinx.com:ip:xlslice:1.0 xlslice_1
create_bd_cell -type ip -vlnv xilinx.com:ip:xlslice:1.0 slice_chan4
set_property -dict {CONFIG.DIN_FROM 511 CONFIG.DIN_TO 384 CONFIG.DIN_WIDTH 512 CONFIG.DOUT_WIDTH 128} [get_bd_cells slice_chan4]
create_bd_cell -type ip -vlnv xilinx.com:ip:xlslice:1.0 slice_chan2
set_property -dict {CONFIG.DIN_FROM 255 CONFIG.DIN_TO 128 CONFIG.DIN_WIDTH 512 CONFIG.DOUT_WIDTH 128} [get_bd_cells slice_chan2]
create_bd_cell -type ip -vlnv xilinx.com:ip:xlslice:1.0 slice_chan3
set_property -dict {CONFIG.DIN_FROM 383 CONFIG.DIN_TO 256 CONFIG.DIN_WIDTH 512 CONFIG.DOUT_WIDTH 128} [get_bd_cells slice_chan3]
create_bd_cell -type ip -vlnv xilinx.com:ip:xlslice:1.0 slice_chan1
set_property -dict {CONFIG.DIN_FROM 127 CONFIG.DIN_TO 0 CONFIG.DIN_WIDTH 512 CONFIG.DOUT_WIDTH 128} [get_bd_cells slice_chan1]
create_bd_cell -type hier read_machine
create_bd_cell -type hier refresh_machine
create_bd_cell -type module -reference mymux mymux_arlen
set_property -dict {CONFIG.width 8} [get_bd_cells mymux_arlen]
create_bd_cell -type module -reference mymux mymux_arsize
set_property -dict {CONFIG.width 3} [get_bd_cells mymux_arsize]
create_bd_cell -type module -reference mymux mymux_arburst
set_property -dict {CONFIG.width 2} [get_bd_cells mymux_arburst]
create_bd_cell -type ip -vlnv xilinx.com:ip:xlconstant:1.1 arlen
set_property -dict {CONFIG.CONST_WIDTH 8} [get_bd_cells arlen]
create_bd_cell -type ip -vlnv xilinx.com:ip:xlconstant:1.1 arsize
set_property -dict {CONFIG.CONST_VAL 6 CONFIG.CONST_WIDTH 3} [get_bd_cells arsize]
create_bd_cell -type ip -vlnv xilinx.com:ip:xlconstant:1.1 arburst
set_property -dict {CONFIG.CONST_WIDTH 2} [get_bd_cells arburst]
create_bd_cell -type hier chan1ts
create_bd_cell -type hier chan2
create_bd_cell -type hier chan2ts
create_bd_cell -type hier chan3ts
create_bd_cell -type hier chan3ts1
create_bd_cell -type hier chan3
create_bd_cell -type hier chan4
create_bd_cell -type ip -vlnv xilinx.com:ip:clk_wiz:6.0 clk_wiz_0
set_property -dict [list \
  CONFIG.CLKOUT1_JITTER 107.164 \
  CONFIG.CLKOUT1_PHASE_ERROR 85.285 \
  CONFIG.CLKOUT1_REQUESTED_OUT_FREQ 125.000 \
  CONFIG.CLK_IN1_BOARD_INTERFACE default_sysclk2_125mhz \
  CONFIG.MMCM_CLKFBOUT_MULT_F 9.625 \
  CONFIG.MMCM_CLKOUT0_DIVIDE_F 9.625 \
  CONFIG.MMCM_DIVCLK_DIVIDE 1 \
  CONFIG.USE_BOARD_FLOW true \
  CONFIG.USE_LOCKED false \
  CONFIG.USE_RESET false \
] [get_bd_cells clk_wiz_0]
create_bd_cell -type hier ethWrapPort0
create_bd_cell -type hier ethWrapPort1
create_bd_cell -type hier ethWrapPort2
create_bd_cell -type hier ethWrapPort3

# ---- hierarchy /chan1 ----
current_bd_instance /chan1
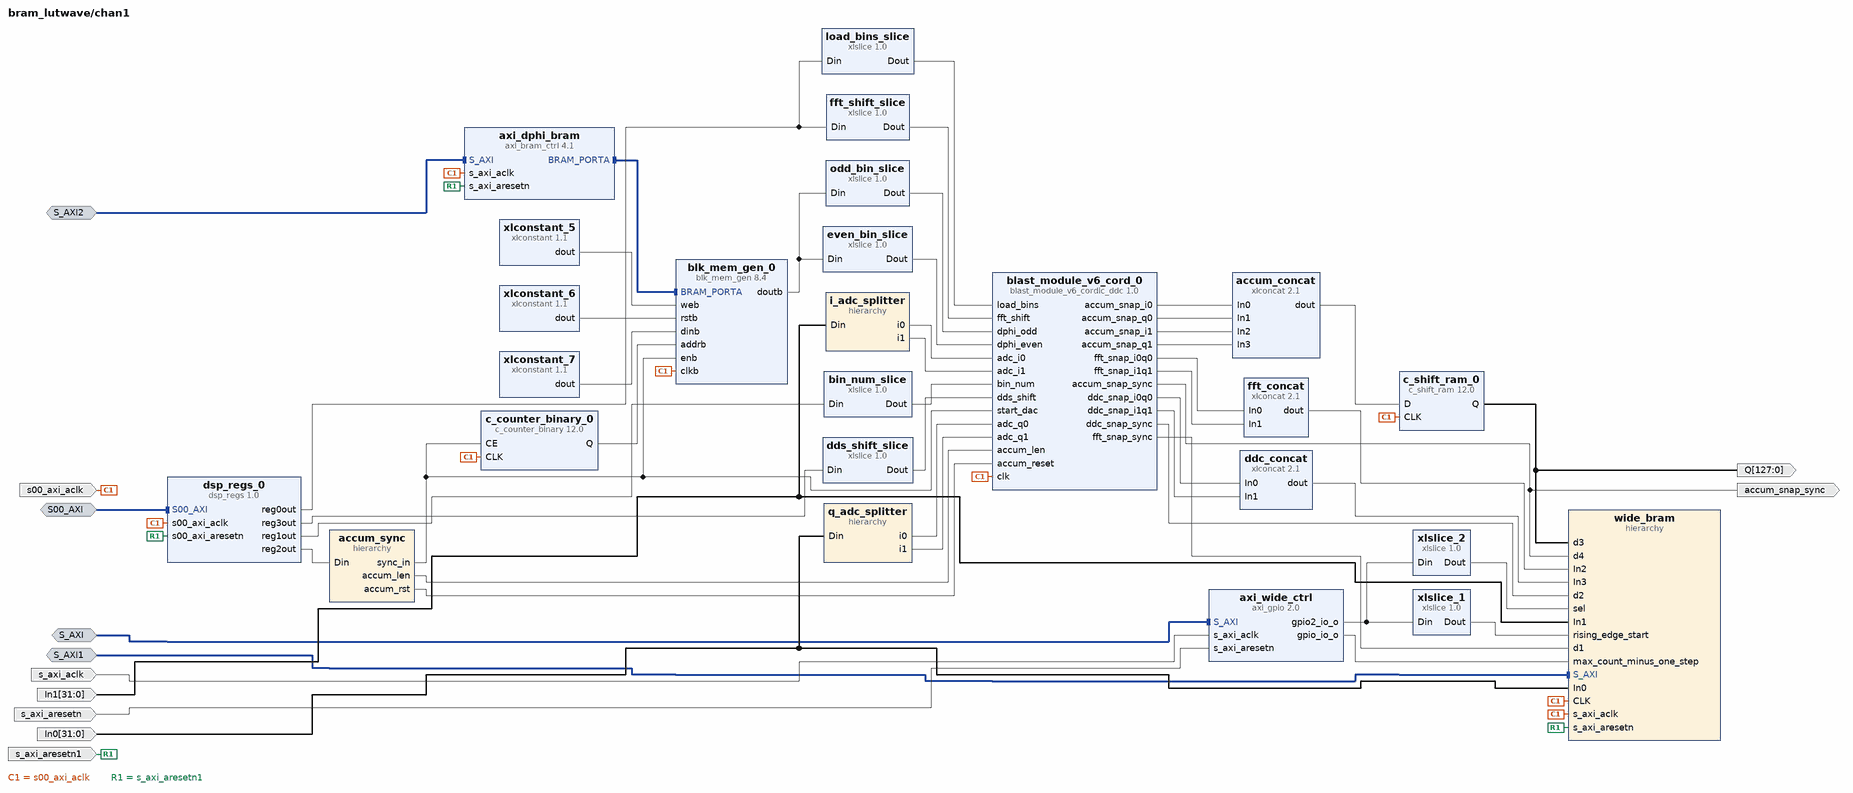
[diagram p4: block diagram inside /chan1]
create_bd_intf_pin -mode Slave -vlnv xilinx.com:interface:aximm_rtl:1.0 S_AXI
create_bd_intf_pin -mode Slave -vlnv xilinx.com:interface:aximm_rtl:1.0 S00_AXI
create_bd_intf_pin -mode Slave -vlnv xilinx.com:interface:aximm_rtl:1.0 S_AXI1
create_bd_intf_pin -mode Slave -vlnv xilinx.com:interface:aximm_rtl:1.0 S_AXI2
create_bd_pin -dir I -type clk s00_axi_aclk
create_bd_pin -dir I -type clk s_axi_aclk
create_bd_pin -dir I -type rst s_axi_aresetn
create_bd_pin -dir I -type rst s_axi_aresetn1
create_bd_pin -dir I -from 31 -to 0 In0
create_bd_pin -dir I -from 31 -to 0 In1
create_bd_pin -dir O -type data accum_snap_sync
create_bd_pin -dir O -from 127 -to 0 -type data Q

create_bd_cell -type ip -vlnv xilinx.com:ip:xlconcat:2.1 accum_concat
set_property -dict {CONFIG.NUM_PORTS 4 CONFIG.dout_width 128} [get_bd_cells accum_concat]
create_bd_cell -type ip -vlnv xilinx.com:ip:xlslice:1.0 xlslice_1
create_bd_cell -type ip -vlnv xilinx.com:ip:xlslice:1.0 xlslice_2
set_property -dict {CONFIG.DIN_FROM 2 CONFIG.DIN_TO 1 CONFIG.DOUT_WIDTH 2} [get_bd_cells xlslice_2]
create_bd_cell -type ip -vlnv xilinx.com:ip:xlslice:1.0 dds_shift_slice
set_property -dict {CONFIG.DIN_FROM 8 CONFIG.DIN_TO 0 CONFIG.DIN_WIDTH 32 CONFIG.DOUT_WIDTH 9} [get_bd_cells dds_shift_slice]
create_bd_cell -type ip -vlnv xilinx.com:ip:xlconcat:2.1 ddc_concat
set_property -dict {CONFIG.NUM_PORTS 2 CONFIG.dout_width 76} [get_bd_cells ddc_concat]
create_bd_cell -type ip -vlnv xilinx.com:ip:xlslice:1.0 load_bins_slice
set_property -dict {CONFIG.DIN_FROM 22 CONFIG.DIN_TO 12 CONFIG.DIN_WIDTH 32 CONFIG.DOUT_WIDTH 11} [get_bd_cells load_bins_slice]
create_bd_cell -type ip -vlnv xilinx.com:ip:axi_gpio:2.0 axi_wide_ctrl
set_property -dict {CONFIG.C_ALL_OUTPUTS 1 CONFIG.C_ALL_OUTPUTS_2 1 CONFIG.C_IS_DUAL 1} [get_bd_cells axi_wide_ctrl]
create_bd_cell -type ip -vlnv xilinx.com:ip:xlconcat:2.1 fft_concat
set_property -dict {CONFIG.NUM_PORTS 2 CONFIG.dout_width 72} [get_bd_cells fft_concat]
create_bd_cell -type ip -vlnv xilinx.com:ip:xlslice:1.0 fft_shift_slice
set_property -dict {CONFIG.DIN_FROM 9 CONFIG.DIN_TO 0 CONFIG.DIN_WIDTH 32 CONFIG.DOUT_WIDTH 10} [get_bd_cells fft_shift_slice]
create_bd_cell -type ip -vlnv xilinx.com:ip:xlslice:1.0 bin_num_slice
set_property -dict {CONFIG.DIN_FROM 9 CONFIG.DIN_TO 0 CONFIG.DIN_WIDTH 32 CONFIG.DOUT_WIDTH 10} [get_bd_cells bin_num_slice]
create_bd_cell -type ip -vlnv user.org:user:dsp_regs:1.0 dsp_regs_0
create_bd_cell -type hier q_adc_splitter
create_bd_cell -type hier accum_sync
create_bd_cell -type hier i_adc_splitter
create_bd_cell -type hier wide_bram
create_bd_cell -type ip -vlnv xilinx.com:ip:axi_bram_ctrl:4.1 axi_dphi_bram
set_property -dict {CONFIG.DATA_WIDTH 32 CONFIG.SINGLE_PORT_BRAM 1} [get_bd_cells axi_dphi_bram]
create_bd_cell -type ip -vlnv xilinx.com:ip:blk_mem_gen:8.4 blk_mem_gen_0
set_property -dict [list \
  CONFIG.Assume_Synchronous_Clk false \
  CONFIG.EN_SAFETY_CKT true \
  CONFIG.Enable_32bit_Address true \
  CONFIG.Enable_B Use_ENB_Pin \
  CONFIG.Memory_Type True_Dual_Port_RAM \
  CONFIG.Operating_Mode_A WRITE_FIRST \
  CONFIG.Operating_Mode_B WRITE_FIRST \
  CONFIG.PRIM_type_to_Implement BRAM \
  CONFIG.Port_B_Clock 100 \
  CONFIG.Port_B_Enable_Rate 100 \
  CONFIG.Port_B_Write_Rate 50 \
  CONFIG.Read_Width_A 32 \
  CONFIG.Read_Width_B 32 \
  CONFIG.Register_PortA_Output_of_Memory_Primitives true \
  CONFIG.Register_PortB_Output_of_Memory_Primitives true \
  CONFIG.Use_RSTA_Pin true \
  CONFIG.Use_RSTB_Pin true \
  CONFIG.Write_Depth_A 512 \
  CONFIG.Write_Width_A 32 \
  CONFIG.Write_Width_B 32 \
  CONFIG.use_bram_block Stand_Alone \
] [get_bd_cells blk_mem_gen_0]
create_bd_cell -type ip -vlnv xilinx.com:ip:c_counter_binary:12.0 c_counter_binary_0
set_property -dict [list \
  CONFIG.CE true \
  CONFIG.Final_Count_Value 7ff \
  CONFIG.Increment_Value 4 \
  CONFIG.Output_Width 32 \
  CONFIG.Restrict_Count true \
] [get_bd_cells c_counter_binary_0]
create_bd_cell -type ip -vlnv xilinx.com:ip:xlconstant:1.1 xlconstant_5
set_property -dict {CONFIG.CONST_VAL 0 CONFIG.CONST_WIDTH 4} [get_bd_cells xlconstant_5]
create_bd_cell -type ip -vlnv xilinx.com:ip:xlslice:1.0 even_bin_slice
set_property -dict {CONFIG.DIN_FROM 15 CONFIG.DIN_TO 0 CONFIG.DIN_WIDTH 32 CONFIG.DOUT_WIDTH 16} [get_bd_cells even_bin_slice]
create_bd_cell -type ip -vlnv xilinx.com:ip:xlslice:1.0 odd_bin_slice
set_property -dict {CONFIG.DIN_FROM 31 CONFIG.DIN_TO 16 CONFIG.DIN_WIDTH 32 CONFIG.DOUT_WIDTH 16} [get_bd_cells odd_bin_slice]
create_bd_cell -type ip -vlnv xilinx.com:ip:xlconstant:1.1 xlconstant_6
set_property -dict {CONFIG.CONST_VAL 0 CONFIG.CONST_WIDTH 1} [get_bd_cells xlconstant_6]
create_bd_cell -type ip -vlnv xilinx.com:ip:xlconstant:1.1 xlconstant_7
set_property -dict {CONFIG.CONST_VAL 0 CONFIG.CONST_WIDTH 32} [get_bd_cells xlconstant_7]
create_bd_cell -type ip -vlnv User_Company:SysGen:blast_module_v6_cordic_ddc:1.0 blast_module_v6_cord_0
create_bd_cell -type ip -vlnv xilinx.com:ip:c_shift_ram:12.0 c_shift_ram_0
set_property -dict [list \
  CONFIG.AsyncInitVal 00000000000000000000000000000000000000000000000000000000000000000000000000000000000000000000000000000000000000000000000000000000 \
  CONFIG.DefaultData 00000000000000000000000000000000000000000000000000000000000000000000000000000000000000000000000000000000000000000000000000000000 \
  CONFIG.Depth 4 \
  CONFIG.Width 128 \
] [get_bd_cells c_shift_ram_0]

# ---- hierarchy /chan1/q_adc_splitter ----
current_bd_instance /chan1/q_adc_splitter
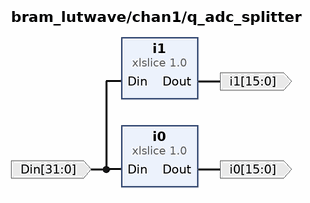
[diagram p5: block diagram inside /chan1/q_adc_splitter]
create_bd_pin -dir I -from 31 -to 0 Din
create_bd_pin -dir O -from 15 -to 0 i0
create_bd_pin -dir O -from 15 -to 0 i1

create_bd_cell -type ip -vlnv xilinx.com:ip:xlslice:1.0 i0
set_property -dict {CONFIG.DIN_FROM 15 CONFIG.DIN_TO 0 CONFIG.DIN_WIDTH 32 CONFIG.DOUT_WIDTH 16} [get_bd_cells i0]
create_bd_cell -type ip -vlnv xilinx.com:ip:xlslice:1.0 i1
set_property -dict {CONFIG.DIN_FROM 31 CONFIG.DIN_TO 16 CONFIG.DIN_WIDTH 32 CONFIG.DOUT_WIDTH 16} [get_bd_cells i1]

# ---- hierarchy /chan1/accum_sync ----
current_bd_instance /chan1/accum_sync
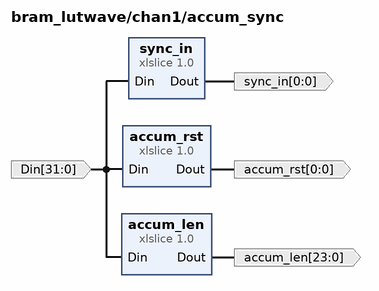
[diagram p6: block diagram inside /chan1/accum_sync]
create_bd_pin -dir I -from 31 -to 0 Din
create_bd_pin -dir O -from 23 -to 0 accum_len
create_bd_pin -dir O -from 0 -to 0 accum_rst
create_bd_pin -dir O -from 0 -to 0 sync_in

create_bd_cell -type ip -vlnv xilinx.com:ip:xlslice:1.0 accum_len
set_property -dict {CONFIG.DIN_FROM 23 CONFIG.DIN_TO 0 CONFIG.DIN_WIDTH 32 CONFIG.DOUT_WIDTH 24} [get_bd_cells accum_len]
create_bd_cell -type ip -vlnv xilinx.com:ip:xlslice:1.0 accum_rst
set_property -dict {CONFIG.DIN_FROM 24 CONFIG.DIN_TO 24 CONFIG.DIN_WIDTH 32 CONFIG.DOUT_WIDTH 1} [get_bd_cells accum_rst]
create_bd_cell -type ip -vlnv xilinx.com:ip:xlslice:1.0 sync_in
set_property -dict {CONFIG.DIN_FROM 26 CONFIG.DIN_TO 26 CONFIG.DIN_WIDTH 32 CONFIG.DOUT_WIDTH 1} [get_bd_cells sync_in]

# ---- hierarchy /chan1/i_adc_splitter ----
current_bd_instance /chan1/i_adc_splitter
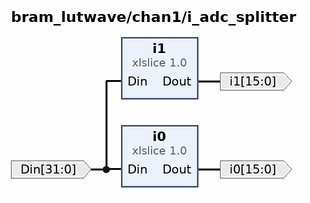
[diagram p7: block diagram inside /chan1/i_adc_splitter]
create_bd_pin -dir I -from 31 -to 0 Din
create_bd_pin -dir O -from 15 -to 0 i0
create_bd_pin -dir O -from 15 -to 0 i1

create_bd_cell -type ip -vlnv xilinx.com:ip:xlslice:1.0 i0
set_property -dict {CONFIG.DIN_FROM 15 CONFIG.DIN_TO 0 CONFIG.DIN_WIDTH 32 CONFIG.DOUT_WIDTH 16} [get_bd_cells i0]
create_bd_cell -type ip -vlnv xilinx.com:ip:xlslice:1.0 i1
set_property -dict {CONFIG.DIN_FROM 31 CONFIG.DIN_TO 16 CONFIG.DIN_WIDTH 32 CONFIG.DOUT_WIDTH 16} [get_bd_cells i1]

# ---- hierarchy /chan1/wide_bram ----
current_bd_instance /chan1/wide_bram
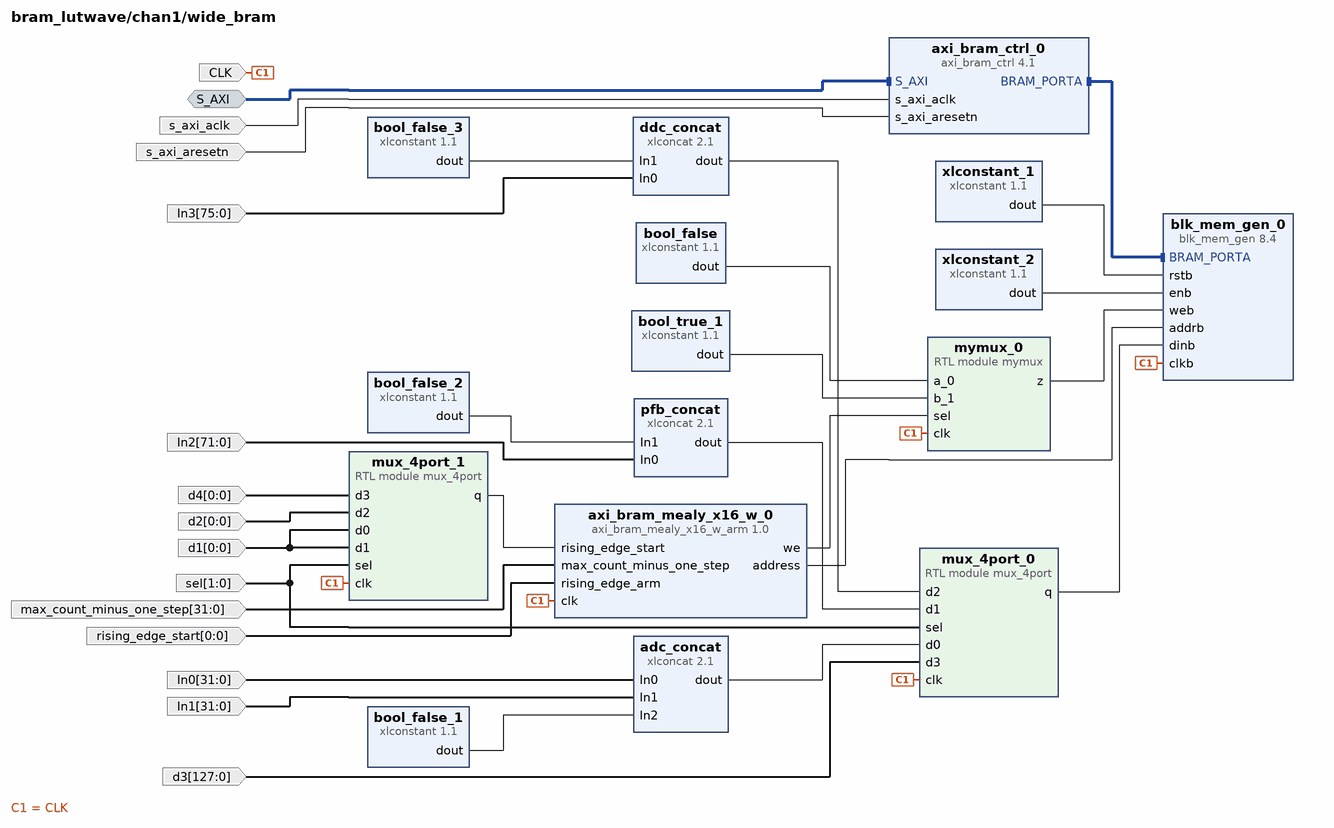
[diagram p8: block diagram inside /chan1/wide_bram]
create_bd_intf_pin -mode Slave -vlnv xilinx.com:interface:aximm_rtl:1.0 S_AXI
create_bd_pin -dir I -type clk s_axi_aclk
create_bd_pin -dir I -type rst s_axi_aresetn
create_bd_pin -dir I -type clk CLK
create_bd_pin -dir I -from 31 -to 0 -type data max_count_minus_one_step
create_bd_pin -dir I -from 0 -to 0 -type data rising_edge_start
create_bd_pin -dir I -from 1 -to 0 sel
create_bd_pin -dir I -from 31 -to 0 In0
create_bd_pin -dir I -from 31 -to 0 In1
create_bd_pin -dir I -from 71 -to 0 In2
create_bd_pin -dir I -from 75 -to 0 In3
create_bd_pin -dir I -from 127 -to 0 d3
create_bd_pin -dir I -from 0 -to 0 d4
create_bd_pin -dir I -from 0 -to 0 d2
create_bd_pin -dir I -from 0 -to 0 d1

create_bd_cell -type ip -vlnv xilinx.com:ip:axi_bram_ctrl:4.1 axi_bram_ctrl_0
set_property -dict {CONFIG.DATA_WIDTH 128 CONFIG.SINGLE_PORT_BRAM 1} [get_bd_cells axi_bram_ctrl_0]
create_bd_cell -type ip -vlnv xilinx.com:ip:xlconstant:1.1 xlconstant_1
set_property -dict {CONFIG.CONST_VAL 0} [get_bd_cells xlconstant_1]
create_bd_cell -type ip -vlnv xilinx.com:ip:xlconstant:1.1 xlconstant_2
set_property -dict {CONFIG.CONST_VAL 1} [get_bd_cells xlconstant_2]
create_bd_cell -type ip -vlnv xilinx.com:ip:blk_mem_gen:8.4 blk_mem_gen_0
set_property -dict [list \
  CONFIG.Enable_32bit_Address true \
  CONFIG.Memory_Type True_Dual_Port_RAM \
  CONFIG.PRIM_type_to_Implement URAM \
  CONFIG.Port_B_Clock 100 \
  CONFIG.Port_B_Enable_Rate 100 \
  CONFIG.Port_B_Write_Rate 50 \
  CONFIG.Use_RSTA_Pin true \
  CONFIG.Use_RSTB_Pin true \
  CONFIG.Write_Depth_A 2048 \
  CONFIG.Write_Width_A 128 \
  CONFIG.use_bram_block Stand_Alone \
] [get_bd_cells blk_mem_gen_0]
create_bd_cell -type ip -vlnv xilinx.com:ip:xlconstant:1.1 bool_false
set_property -dict {CONFIG.CONST_VAL 0 CONFIG.CONST_WIDTH 16} [get_bd_cells bool_false]
create_bd_cell -type ip -vlnv xilinx.com:ip:xlconstant:1.1 bool_true_1
set_property -dict {CONFIG.CONST_VAL 65535 CONFIG.CONST_WIDTH 16} [get_bd_cells bool_true_1]
create_bd_cell -type module -reference mux_4port mux_4port_0
create_bd_cell -type ip -vlnv xilinx.com:ip:xlconcat:2.1 adc_concat
set_property -dict {CONFIG.IN0_WIDTH 32 CONFIG.IN1_WIDTH 32 CONFIG.IN2_WIDTH 64 CONFIG.NUM_PORTS 3} [get_bd_cells adc_concat]
create_bd_cell -type ip -vlnv xilinx.com:ip:xlconstant:1.1 bool_false_1
set_property -dict {CONFIG.CONST_VAL 0 CONFIG.CONST_WIDTH 64} [get_bd_cells bool_false_1]
create_bd_cell -type ip -vlnv xilinx.com:ip:xlconcat:2.1 pfb_concat
set_property -dict {CONFIG.IN0_WIDTH 72 CONFIG.IN1_WIDTH 56 CONFIG.NUM_PORTS 2} [get_bd_cells pfb_concat]
create_bd_cell -type ip -vlnv xilinx.com:ip:xlconstant:1.1 bool_false_2
set_property -dict {CONFIG.CONST_VAL 0 CONFIG.CONST_WIDTH 56} [get_bd_cells bool_false_2]
create_bd_cell -type ip -vlnv xilinx.com:ip:xlconcat:2.1 ddc_concat
set_property -dict {CONFIG.IN0_WIDTH 76 CONFIG.IN1_WIDTH 52 CONFIG.NUM_PORTS 2} [get_bd_cells ddc_concat]
create_bd_cell -type ip -vlnv xilinx.com:ip:xlconstant:1.1 bool_false_3
set_property -dict {CONFIG.CONST_VAL 0 CONFIG.CONST_WIDTH 52} [get_bd_cells bool_false_3]
create_bd_cell -type module -reference mymux mymux_0
set_property -dict {CONFIG.width 16} [get_bd_cells mymux_0]
create_bd_cell -type ip -vlnv User_Company:SysGen:axi_bram_mealy_x16_w_arm:1.0 axi_bram_mealy_x16_w_0
create_bd_cell -type module -reference mux_4port mux_4port_1
set_property -dict {CONFIG.width 1} [get_bd_cells mux_4port_1]

# ---- hierarchy /read_machine ----
current_bd_instance /read_machine
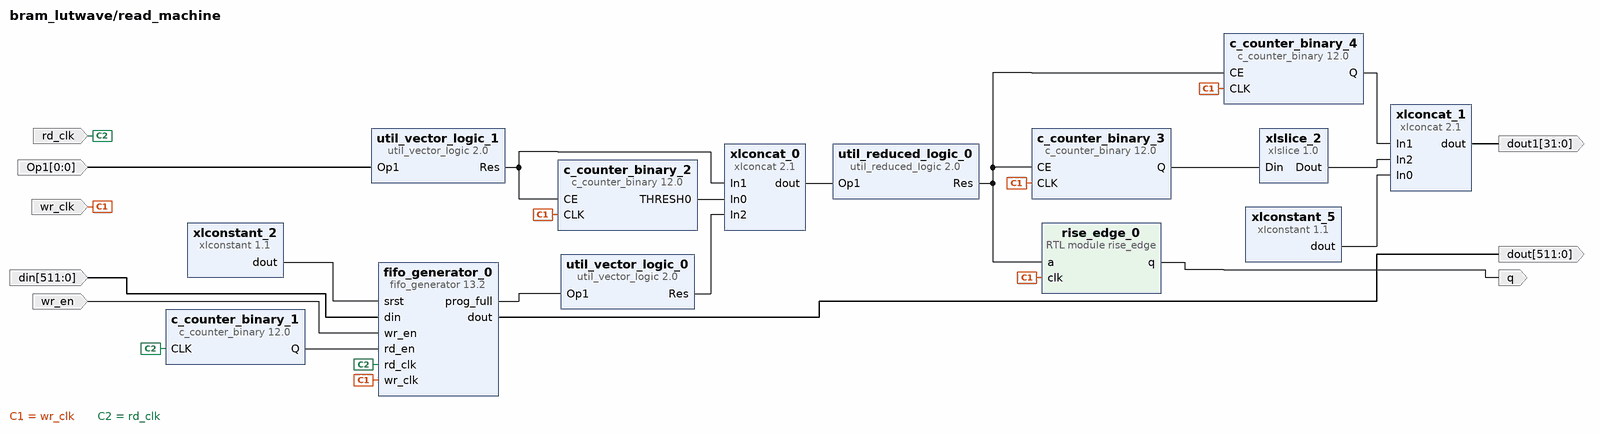
[diagram p9: block diagram inside /read_machine]
create_bd_pin -dir I -type clk wr_clk
create_bd_pin -dir I -type clk rd_clk
create_bd_pin -dir I -from 511 -to 0 din
create_bd_pin -dir O -from 511 -to 0 dout
create_bd_pin -dir I wr_en
create_bd_pin -dir I -from 0 -to 0 Op1
create_bd_pin -dir O -from 31 -to 0 dout1
create_bd_pin -dir O q

create_bd_cell -type ip -vlnv xilinx.com:ip:xlconstant:1.1 xlconstant_2
set_property -dict {CONFIG.CONST_VAL 0} [get_bd_cells xlconstant_2]
create_bd_cell -type ip -vlnv xilinx.com:ip:fifo_generator:13.2 fifo_generator_0
set_property -dict [list \
  CONFIG.Fifo_Implementation Independent_Clocks_Builtin_FIFO \
  CONFIG.Full_Threshold_Assert_Value 1548 \
  CONFIG.Input_Data_Width 512 \
  CONFIG.Input_Depth 2048 \
  CONFIG.Programmable_Full_Type Single_Programmable_Full_Threshold_Constant \
  CONFIG.Read_Clock_Frequency 256 \
  CONFIG.Write_Clock_Frequency 333 \
] [get_bd_cells fifo_generator_0]
create_bd_cell -type ip -vlnv xilinx.com:ip:util_vector_logic:2.0 util_vector_logic_0
set_property -dict {CONFIG.C_OPERATION not CONFIG.C_SIZE 1} [get_bd_cells util_vector_logic_0]
create_bd_cell -type ip -vlnv xilinx.com:ip:c_counter_binary:12.0 c_counter_binary_1
set_property -dict {CONFIG.Output_Width 1} [get_bd_cells c_counter_binary_1]
create_bd_cell -type ip -vlnv xilinx.com:ip:c_counter_binary:12.0 c_counter_binary_2
set_property -dict [list \
  CONFIG.CE true \
  CONFIG.Output_Width 2 \
  CONFIG.Sync_Threshold_Output true \
  CONFIG.Threshold_Value 2 \
] [get_bd_cells c_counter_binary_2]
create_bd_cell -type ip -vlnv xilinx.com:ip:util_vector_logic:2.0 util_vector_logic_1
set_property -dict {CONFIG.C_OPERATION not CONFIG.C_SIZE 1} [get_bd_cells util_vector_logic_1]
create_bd_cell -type ip -vlnv xilinx.com:ip:xlconcat:2.1 xlconcat_0
set_property -dict {CONFIG.NUM_PORTS 3} [get_bd_cells xlconcat_0]
create_bd_cell -type ip -vlnv xilinx.com:ip:util_reduced_logic:2.0 util_reduced_logic_0
set_property -dict {CONFIG.C_SIZE 3} [get_bd_cells util_reduced_logic_0]
create_bd_cell -type ip -vlnv xilinx.com:ip:c_counter_binary:12.0 c_counter_binary_3
set_property -dict [list \
  CONFIG.CE true \
  CONFIG.Final_Count_Value fffffe \
  CONFIG.Increment_Value 80 \
  CONFIG.Output_Width 32 \
  CONFIG.Restrict_Count true \
] [get_bd_cells c_counter_binary_3]
create_bd_cell -type ip -vlnv xilinx.com:ip:xlslice:1.0 xlslice_2
set_property -dict {CONFIG.DIN_FROM 31 CONFIG.DIN_TO 5 CONFIG.DOUT_WIDTH 27} [get_bd_cells xlslice_2]
create_bd_cell -type ip -vlnv xilinx.com:ip:xlconcat:2.1 xlconcat_1
set_property -dict {CONFIG.IN0_WIDTH 3 CONFIG.IN1_WIDTH 2 CONFIG.IN2_WIDTH 27 CONFIG.NUM_PORTS 3} [get_bd_cells xlconcat_1]
create_bd_cell -type ip -vlnv xilinx.com:ip:xlconstant:1.1 xlconstant_5
set_property -dict {CONFIG.CONST_VAL 0 CONFIG.CONST_WIDTH 3} [get_bd_cells xlconstant_5]
create_bd_cell -type ip -vlnv xilinx.com:ip:c_counter_binary:12.0 c_counter_binary_4
set_property -dict {CONFIG.CE true CONFIG.Output_Width 2 CONFIG.Sync_Threshold_Output false} [get_bd_cells c_counter_binary_4]
create_bd_cell -type module -reference rise_edge rise_edge_0

# ---- hierarchy /refresh_machine ----
current_bd_instance /refresh_machine
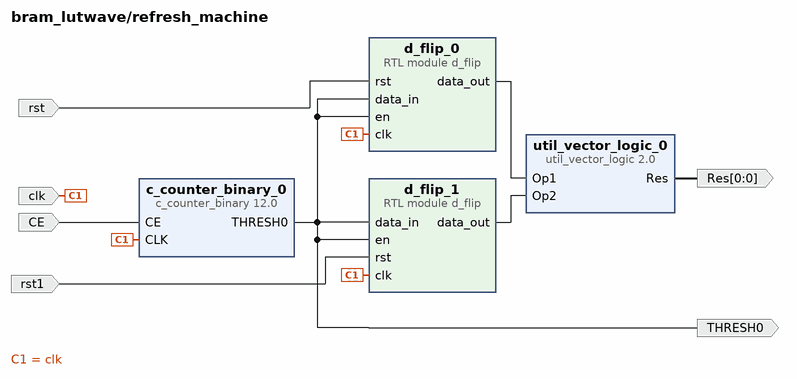
[diagram p10: block diagram inside /refresh_machine]
create_bd_pin -dir I -type rst rst
create_bd_pin -dir I -type rst rst1
create_bd_pin -dir I -type ce CE
create_bd_pin -dir O -type data THRESH0
create_bd_pin -dir O -from 0 -to 0 Res
create_bd_pin -dir I -type clk clk

create_bd_cell -type ip -vlnv xilinx.com:ip:util_vector_logic:2.0 util_vector_logic_0
set_property -dict {CONFIG.C_OPERATION or CONFIG.C_SIZE 1} [get_bd_cells util_vector_logic_0]
create_bd_cell -type module -reference d_flip d_flip_0
set_property -dict {CONFIG.width 1} [get_bd_cells d_flip_0]
create_bd_cell -type module -reference d_flip d_flip_1
set_property -dict {CONFIG.width 1} [get_bd_cells d_flip_1]
create_bd_cell -type ip -vlnv xilinx.com:ip:c_counter_binary:12.0 c_counter_binary_0
set_property -dict [list \
  CONFIG.CE true \
  CONFIG.Final_Count_Value bb7 \
  CONFIG.Output_Width 12 \
  CONFIG.Restrict_Count true \
  CONFIG.Sync_Threshold_Output true \
  CONFIG.Threshold_Value bb7 \
] [get_bd_cells c_counter_binary_0]

# ---- hierarchy /chan1ts ----
current_bd_instance /chan1ts
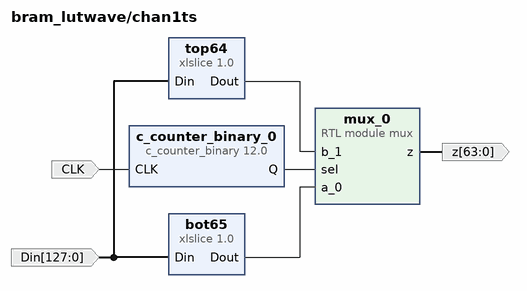
[diagram p11: block diagram inside /chan1ts]
create_bd_pin -dir I -from 127 -to 0 Din
create_bd_pin -dir O -from 63 -to 0 z
create_bd_pin -dir I -type clk CLK

create_bd_cell -type ip -vlnv xilinx.com:ip:xlslice:1.0 top64
set_property -dict {CONFIG.DIN_FROM 127 CONFIG.DIN_TO 64 CONFIG.DIN_WIDTH 128 CONFIG.DOUT_WIDTH 64} [get_bd_cells top64]
create_bd_cell -type module -reference mux mux_0
set_property -dict {CONFIG.width 64} [get_bd_cells mux_0]
create_bd_cell -type ip -vlnv xilinx.com:ip:c_counter_binary:12.0 c_counter_binary_0
set_property -dict {CONFIG.Output_Width 1} [get_bd_cells c_counter_binary_0]
create_bd_cell -type ip -vlnv xilinx.com:ip:xlslice:1.0 bot65
set_property -dict {CONFIG.DIN_FROM 63 CONFIG.DIN_TO 0 CONFIG.DIN_WIDTH 128 CONFIG.DOUT_WIDTH 64} [get_bd_cells bot65]

# ---- hierarchy /chan2 ----
current_bd_instance /chan2
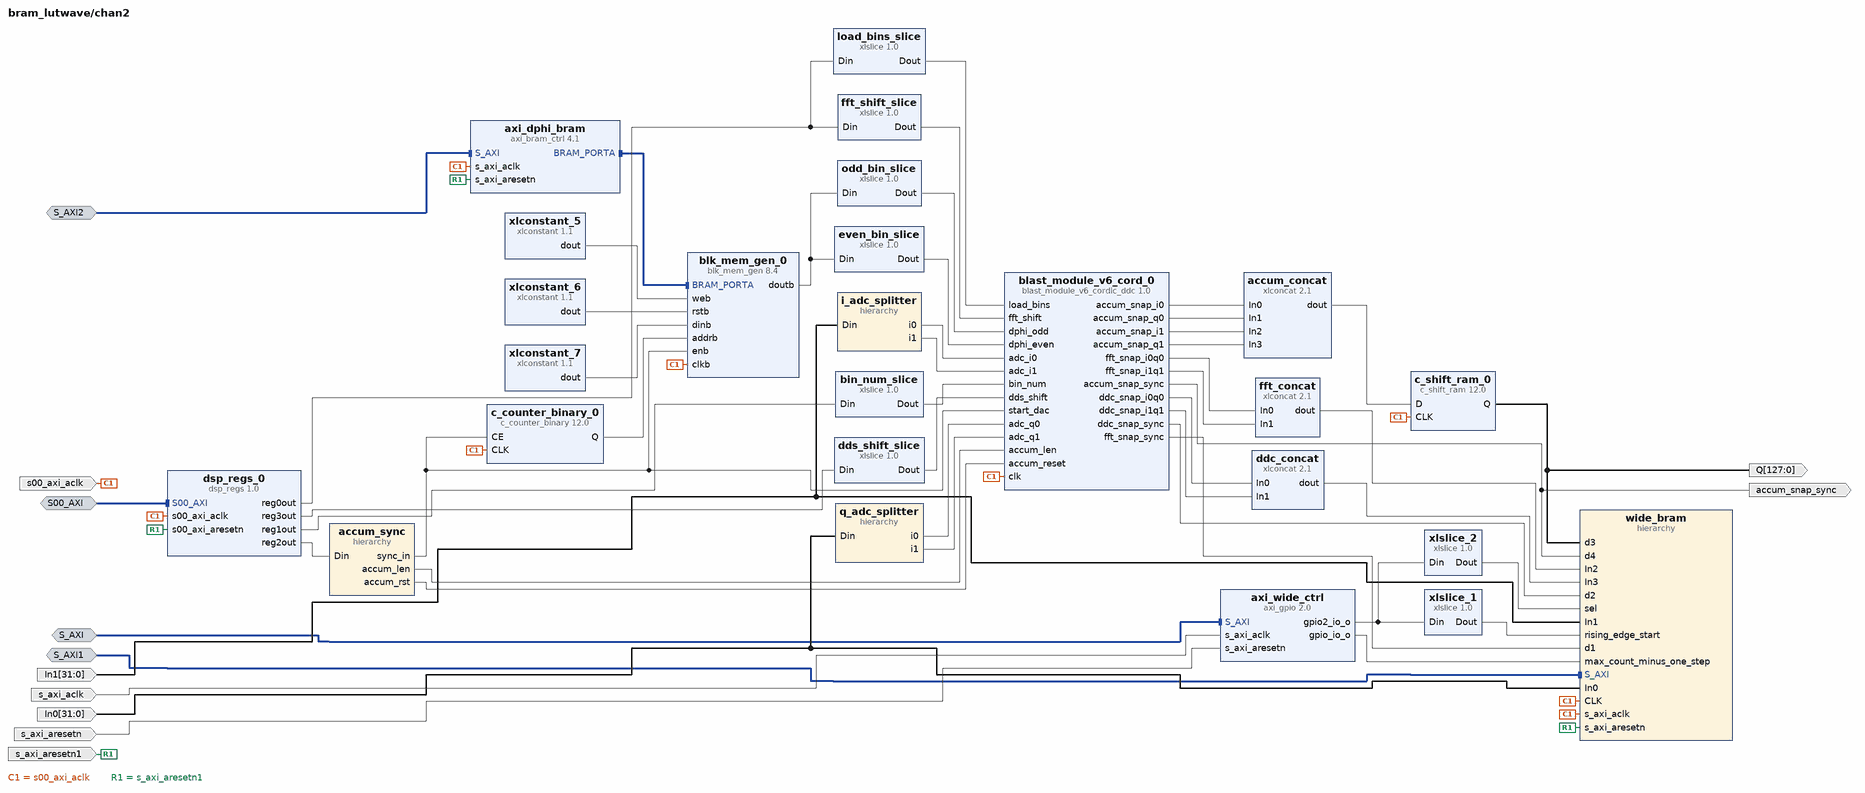
[diagram p12: block diagram inside /chan2]
create_bd_intf_pin -mode Slave -vlnv xilinx.com:interface:aximm_rtl:1.0 S_AXI
create_bd_intf_pin -mode Slave -vlnv xilinx.com:interface:aximm_rtl:1.0 S00_AXI
create_bd_intf_pin -mode Slave -vlnv xilinx.com:interface:aximm_rtl:1.0 S_AXI1
create_bd_intf_pin -mode Slave -vlnv xilinx.com:interface:aximm_rtl:1.0 S_AXI2
create_bd_pin -dir I -type clk s00_axi_aclk
create_bd_pin -dir I -type clk s_axi_aclk
create_bd_pin -dir I -type rst s_axi_aresetn
create_bd_pin -dir I -type rst s_axi_aresetn1
create_bd_pin -dir I -from 31 -to 0 In0
create_bd_pin -dir I -from 31 -to 0 In1
create_bd_pin -dir O -type data accum_snap_sync
create_bd_pin -dir O -from 127 -to 0 -type data Q

create_bd_cell -type ip -vlnv xilinx.com:ip:xlconcat:2.1 accum_concat
set_property -dict {CONFIG.NUM_PORTS 4 CONFIG.dout_width 128} [get_bd_cells accum_concat]
create_bd_cell -type ip -vlnv xilinx.com:ip:xlslice:1.0 xlslice_1
create_bd_cell -type ip -vlnv xilinx.com:ip:xlslice:1.0 xlslice_2
set_property -dict {CONFIG.DIN_FROM 2 CONFIG.DIN_TO 1 CONFIG.DOUT_WIDTH 2} [get_bd_cells xlslice_2]
create_bd_cell -type ip -vlnv xilinx.com:ip:xlslice:1.0 dds_shift_slice
set_property -dict {CONFIG.DIN_FROM 8 CONFIG.DIN_TO 0 CONFIG.DIN_WIDTH 32 CONFIG.DOUT_WIDTH 9} [get_bd_cells dds_shift_slice]
create_bd_cell -type ip -vlnv xilinx.com:ip:xlconcat:2.1 ddc_concat
set_property -dict {CONFIG.NUM_PORTS 2 CONFIG.dout_width 76} [get_bd_cells ddc_concat]
create_bd_cell -type ip -vlnv xilinx.com:ip:xlslice:1.0 load_bins_slice
set_property -dict {CONFIG.DIN_FROM 22 CONFIG.DIN_TO 12 CONFIG.DIN_WIDTH 32 CONFIG.DOUT_WIDTH 11} [get_bd_cells load_bins_slice]
create_bd_cell -type ip -vlnv xilinx.com:ip:axi_gpio:2.0 axi_wide_ctrl
set_property -dict {CONFIG.C_ALL_OUTPUTS 1 CONFIG.C_ALL_OUTPUTS_2 1 CONFIG.C_IS_DUAL 1} [get_bd_cells axi_wide_ctrl]
create_bd_cell -type ip -vlnv xilinx.com:ip:xlconcat:2.1 fft_concat
set_property -dict {CONFIG.NUM_PORTS 2 CONFIG.dout_width 72} [get_bd_cells fft_concat]
create_bd_cell -type ip -vlnv xilinx.com:ip:xlslice:1.0 fft_shift_slice
set_property -dict {CONFIG.DIN_FROM 9 CONFIG.DIN_TO 0 CONFIG.DIN_WIDTH 32 CONFIG.DOUT_WIDTH 10} [get_bd_cells fft_shift_slice]
create_bd_cell -type ip -vlnv xilinx.com:ip:xlslice:1.0 bin_num_slice
set_property -dict {CONFIG.DIN_FROM 9 CONFIG.DIN_TO 0 CONFIG.DIN_WIDTH 32 CONFIG.DOUT_WIDTH 10} [get_bd_cells bin_num_slice]
create_bd_cell -type ip -vlnv user.org:user:dsp_regs:1.0 dsp_regs_0
create_bd_cell -type hier q_adc_splitter
create_bd_cell -type hier accum_sync
create_bd_cell -type hier i_adc_splitter
create_bd_cell -type hier wide_bram
create_bd_cell -type ip -vlnv xilinx.com:ip:axi_bram_ctrl:4.1 axi_dphi_bram
set_property -dict {CONFIG.DATA_WIDTH 32 CONFIG.SINGLE_PORT_BRAM 1} [get_bd_cells axi_dphi_bram]
create_bd_cell -type ip -vlnv xilinx.com:ip:blk_mem_gen:8.4 blk_mem_gen_0
set_property -dict [list \
  CONFIG.Assume_Synchronous_Clk false \
  CONFIG.EN_SAFETY_CKT true \
  CONFIG.Enable_32bit_Address true \
  CONFIG.Enable_B Use_ENB_Pin \
  CONFIG.Memory_Type True_Dual_Port_RAM \
  CONFIG.Operating_Mode_A WRITE_FIRST \
  CONFIG.Operating_Mode_B WRITE_FIRST \
  CONFIG.PRIM_type_to_Implement BRAM \
  CONFIG.Port_B_Clock 100 \
  CONFIG.Port_B_Enable_Rate 100 \
  CONFIG.Port_B_Write_Rate 50 \
  CONFIG.Read_Width_A 32 \
  CONFIG.Read_Width_B 32 \
  CONFIG.Register_PortA_Output_of_Memory_Primitives true \
  CONFIG.Register_PortB_Output_of_Memory_Primitives true \
  CONFIG.Use_RSTA_Pin true \
  CONFIG.Use_RSTB_Pin true \
  CONFIG.Write_Depth_A 512 \
  CONFIG.Write_Width_A 32 \
  CONFIG.Write_Width_B 32 \
  CONFIG.use_bram_block Stand_Alone \
] [get_bd_cells blk_mem_gen_0]
create_bd_cell -type ip -vlnv xilinx.com:ip:c_counter_binary:12.0 c_counter_binary_0
set_property -dict [list \
  CONFIG.CE true \
  CONFIG.Final_Count_Value 7ff \
  CONFIG.Increment_Value 4 \
  CONFIG.Output_Width 32 \
  CONFIG.Restrict_Count true \
] [get_bd_cells c_counter_binary_0]
create_bd_cell -type ip -vlnv xilinx.com:ip:xlconstant:1.1 xlconstant_5
set_property -dict {CONFIG.CONST_VAL 0 CONFIG.CONST_WIDTH 4} [get_bd_cells xlconstant_5]
create_bd_cell -type ip -vlnv xilinx.com:ip:xlslice:1.0 even_bin_slice
set_property -dict {CONFIG.DIN_FROM 15 CONFIG.DIN_TO 0 CONFIG.DIN_WIDTH 32 CONFIG.DOUT_WIDTH 16} [get_bd_cells even_bin_slice]
create_bd_cell -type ip -vlnv xilinx.com:ip:xlslice:1.0 odd_bin_slice
set_property -dict {CONFIG.DIN_FROM 31 CONFIG.DIN_TO 16 CONFIG.DIN_WIDTH 32 CONFIG.DOUT_WIDTH 16} [get_bd_cells odd_bin_slice]
create_bd_cell -type ip -vlnv xilinx.com:ip:xlconstant:1.1 xlconstant_6
set_property -dict {CONFIG.CONST_VAL 0 CONFIG.CONST_WIDTH 1} [get_bd_cells xlconstant_6]
create_bd_cell -type ip -vlnv xilinx.com:ip:xlconstant:1.1 xlconstant_7
set_property -dict {CONFIG.CONST_VAL 0 CONFIG.CONST_WIDTH 32} [get_bd_cells xlconstant_7]
create_bd_cell -type ip -vlnv User_Company:SysGen:blast_module_v6_cordic_ddc:1.0 blast_module_v6_cord_0
create_bd_cell -type ip -vlnv xilinx.com:ip:c_shift_ram:12.0 c_shift_ram_0
set_property -dict [list \
  CONFIG.AsyncInitVal 00000000000000000000000000000000000000000000000000000000000000000000000000000000000000000000000000000000000000000000000000000000 \
  CONFIG.DefaultData 00000000000000000000000000000000000000000000000000000000000000000000000000000000000000000000000000000000000000000000000000000000 \
  CONFIG.Depth 4 \
  CONFIG.Width 128 \
] [get_bd_cells c_shift_ram_0]
